# Altium project Microcontroller Hardware.PrjPcb (part 1 of 3)
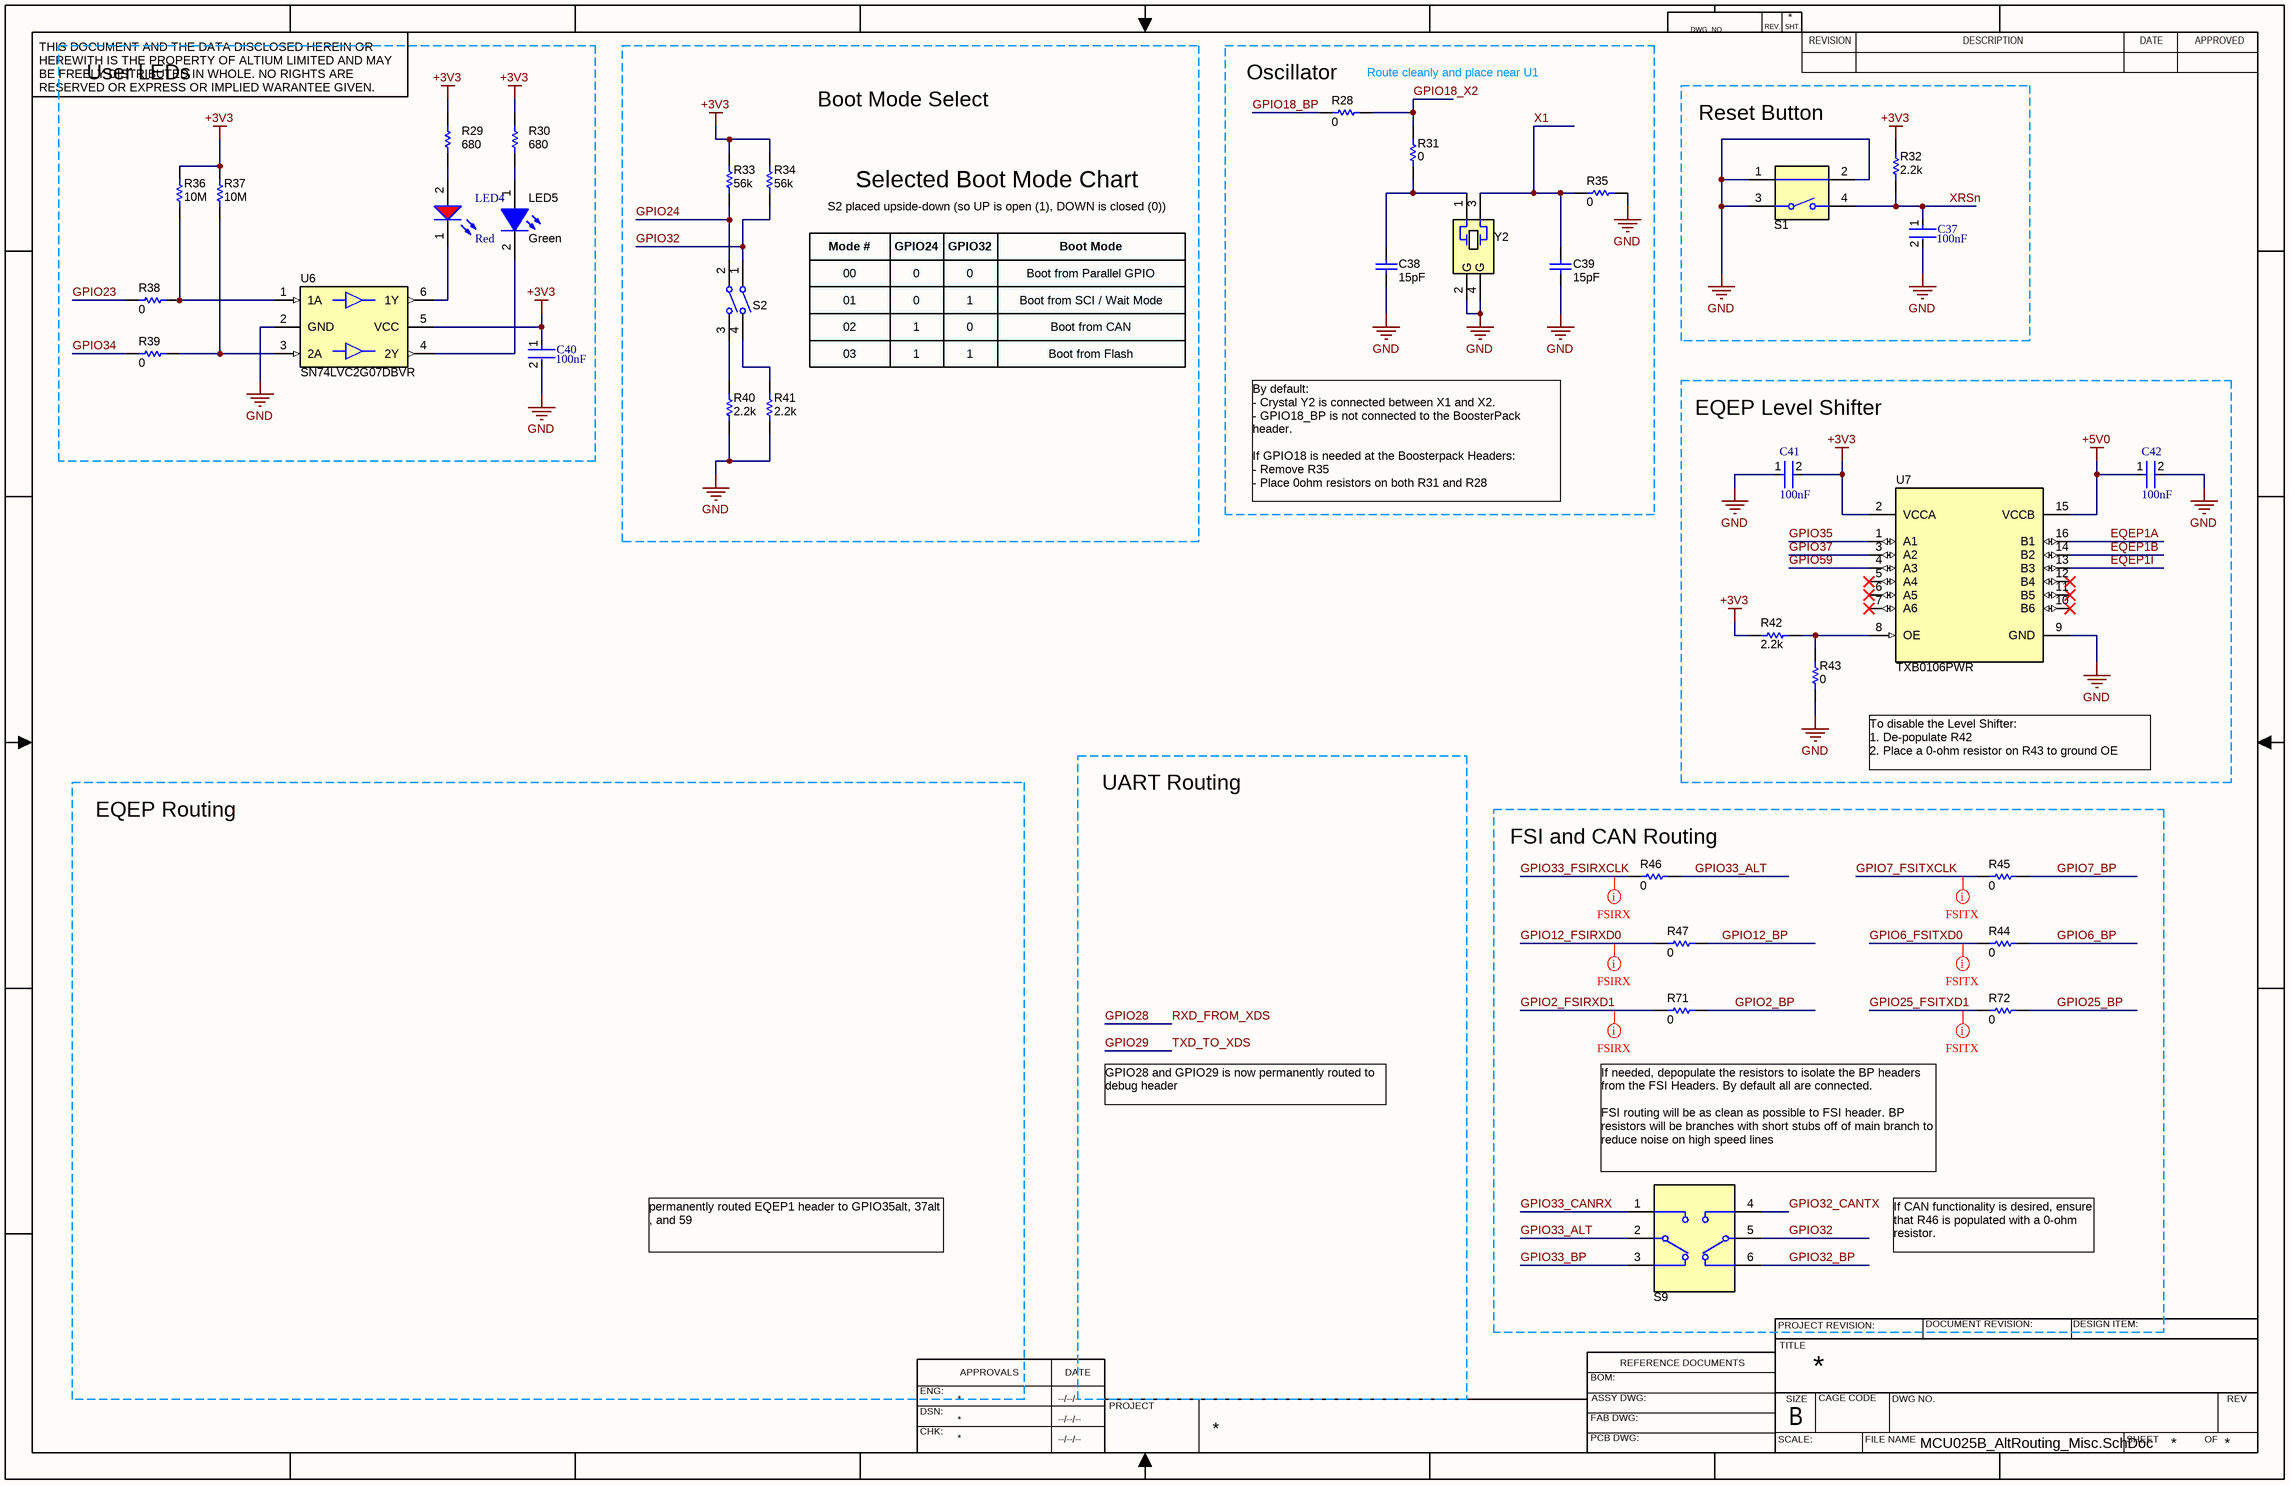
[diagram p0: MCU025B_AltRouting_Misc.SchDoc]
8 sheets, 205 parts. Net scope: global (net labels, ports and power ports of the same name join across sheets).
Board file: MCU025B.PcbDoc
Sheets:
  MCU025B_AltRouting_Misc.SchDoc
  MCU025B_Block_Diagram.SchDoc
  MCU025B_Connectors.SchDoc
  MCU025B_F280049C_Device.SchDoc
  MCU025B_Hardware.SchDoc
  MCU025B_XDS110_MCU.SchDoc
  MCU025B_XDS110_Target_Interface.SchDoc
  MCU025B_XDS110_USB_Power.SchDoc

## Sheet MCU025B_AltRouting_Misc.SchDoc
size 431 x 279 mm; PageSetup: Record=PageOptions|CenterHorizontal=True|CenterVertical=True|PrintScale=1.00|XCorrection=1.00|YCorrection=1.00|PrintKind=0|BorderSize=5000000|LeftOffset=0|BottomOffset=0|Orientation=2|PaperLength=1000|PaperWidth=1000|Scale=100|PaperSource=15|PrintQuality=600|MediaType=1|DitherType=10|PaperKind=Letter|PrintScaleMode=1; Organization: ORGANIZATION; Address1: ADDRESS 1; Address2: ADDRESS 2; Address3: ADDRESS 3; Address4: ADDRESS 4; Revision: -; ENG_APP_DATE: --/--/--; DSN_APP_DATE: --/--/--; CHK_APP_DATE: --/--/--

### Parts
C37  Capacitance: 100nF  [FP-CL10-IPC_C]  (hidden comment: CL10B104KA8NFNC)
C38  ValueDisplayed: 15pF  [0402]  (hidden comment: GRM1555C1H150JA01D)
C39  ValueDisplayed: 15pF  [0402]  (hidden comment: GRM1555C1H150JA01D)
C40  Capacitance: 100nF  [FP-CL10-IPC_C]  (hidden comment: CL10B104KA8NFNC)
C41  Capacitance: 100nF  [FP-CL10-IPC_C]  (hidden comment: CL10B104KA8NFNC)
C42  Capacitance: 100nF  [FP-CL10-IPC_C]  (hidden comment: CL10B104KA8NFNC)
LED4  Color: Red  [WL-SMCW_0805_150080xx75000]  (hidden comment: 150080SS75000)
LED5  value Green  [LED_LTST-C171]  (hidden comment: LTST-C171GKT)
R28  ValueDisplayed: 0  [0603]  (hidden comment: CRCW06030000Z0EA)
R29  ValueDisplayed: 680  [0402]  (hidden comment: CRCW0402680RJNED)
R30  ValueDisplayed: 680  [0402]  (hidden comment: CRCW0402680RJNED)
R31  ValueDisplayed: 0  [0603]  (hidden comment: CRCW06030000Z0EA)
R32  ValueDisplayed: 2.2k  [0402]  (hidden comment: CRCW04022K20JNED)
R33  ValueDisplayed: 56k  [0402]  (hidden comment: CRCW040256K0JNED)
R34  ValueDisplayed: 56k  [0402]  (hidden comment: CRCW040256K0JNED)
R35  ValueDisplayed: 0  [0603]  (hidden comment: CRCW06030000Z0EA)
R36  ValueDisplayed: 10M  [0402]  (hidden comment: CRCW040210M0JNED)
R37  ValueDisplayed: 10M  [0402]  (hidden comment: CRCW040210M0JNED)
R38  ValueDisplayed: 0  [0603]  (hidden comment: CRCW06030000Z0EA)
R39  ValueDisplayed: 0  [0603]  (hidden comment: CRCW06030000Z0EA)
R40  ValueDisplayed: 2.2k  [0402]  (hidden comment: CRCW04022K20JNED)
R41  ValueDisplayed: 2.2k  [0402]  (hidden comment: CRCW04022K20JNED)
R42  ValueDisplayed: 2.2k  [0603]  (hidden comment: CRCW06032K20JNEA)
R43  ValueDisplayed: 0  [0603]  (hidden comment: CRCW06030000Z0EA)
R44  ValueDisplayed: 0  [0603]  (hidden comment: CRCW06030000Z0EA)
R45  ValueDisplayed: 0  [0603]  (hidden comment: CRCW06030000Z0EA)
R46  ValueDisplayed: 0  [0603]  (hidden comment: CRCW06030000Z0EA)
R47  ValueDisplayed: 0  [0603]  (hidden comment: CRCW06030000Z0EA)
R71  ValueDisplayed: 0  [0603]  (hidden comment: CRCW06030000Z0EA)
R72  ValueDisplayed: 0  [0603]  (hidden comment: CRCW06030000Z0EA)
S1  1188E-1K2-V-TR  [SW_1188E]  (value not drawn)
S2  218-2LPST  [SW_218-2LP]  (value not drawn)
S9  CAS-220TA  [SW_CAS-220TA]  (value not drawn)
U6  SN74LVC2G07DBVR  [DBV0006A_N]
U7  TXB0106PWR  [PW0016A_N]
Y2  ECS-200-18-30B-AGN-TR  [ECS_ECX-53B]  (value not drawn)

### Nets
+3V3: C40.1 C41.2 R29.2 R30.2 R32.2 R33.2 R34.2 R36.2 R37.2 R42.1 U6.5(VCC) U7.2(VCCA)
+5V0: C42.1 U7.15(VCCB)
GND: C37.2 C38.2 C39.2 C40.2 C41.1 C42.2 R35.2 R40.1 R41.1 R43.1 S1.1 S1.2 S1.3 U6.2(GND) U7.9(GND) Y2.2(GND) Y2.4(GND)
EQEP1A: U7.16(B1)
EQEP1B: U7.14(B2)
EQEP1I: U7.13(B3)
GPIO2_BP: R71.2
GPIO2_FSIRXD1: R71.1
GPIO6_BP: R44.2
GPIO6_FSITXD0: R44.1
GPIO7_BP: R45.2
GPIO7_FSITXCLK: R45.1
GPIO12_BP: R47.2
GPIO12_FSIRXD0: R47.1
GPIO18_BP: R28.1
GPIO18_X2: R28.2 R31.2
GPIO23: R38.1
GPIO24: R33.1 S2.2
GPIO25_BP: R72.2
GPIO25_FSITXD1: R72.1
GPIO32: R34.1 S2.1 S9.5
GPIO32_BP: S9.6
GPIO32_CANTX: S9.4
GPIO33_ALT: R46.2 S9.2
GPIO33_BP: S9.3
GPIO33_CANRX: S9.1
GPIO33_FSIRXCLK: R46.1
GPIO34: R39.1
GPIO35: U7.1(A1)
GPIO37: U7.3(A2)
GPIO59: U7.4(A3)
X1: C39.1 R35.1 Y2.3
XRSn: C37.1 R32.1 S1.4
NetC38_1: C38.1 R31.1 Y2.1
NetLED4_1: LED4.1(K) U6.6(1Y)
NetLED4_2: LED4.2(A) R29.1
NetLED5_1: LED5.1(A) R30.1
NetLED5_2: LED5.2(K) U6.4(2Y)
NetR36_1: R36.1 R38.2 U6.1(1A)
NetR37_1: R37.1 R39.2 U6.3(2A)
NetR40_2: R40.2 S2.3
NetR41_2: R41.2 S2.4
NetR42_2: R42.2 R43.2 U7.8(OE)

Not connected (* = marked no-connect by the designer): U7 5(A4)* 6(A5)* 7(A6)* 10(B6)* 11(B5)* 12(B4)*

### Layout directives
net class FSIRX: GPIO2_FSIRXD1, GPIO12_FSIRXD0, GPIO33_FSIRXCLK
net class FSITX: GPIO6_FSITXD0, GPIO7_FSITXCLK, GPIO25_FSITXD1

### Notes on the sheet
- User LEDs
- Boot Mode Select
- (near R28) Oscillator
- (near R28) Route cleanly and place near U1
- Reset Button
- Selected Boot Mode Chart
- (near R34) S2 placed upside-down (so UP is open (1), DOWN is closed (0))
- Mode #
- 00
- 01
- GPIO24
- 0
- GPIO32
- 1
- Boot Mode
- Boot from Parallel GPIO
- Boot from SCI / Wait Mode
- 02
- 03
- Boot from CAN
- Boot from Flash
- EQEP Level Shifter
- By default:
  - Crystal Y2 is connected between X1 and X2.
  - GPIO18_BP is not connected to the BoosterPack header.
  If GPIO18 is needed at the Boosterpack Headers:
  - Remove R35
  - Place 0ohm resistors on both R31 and R28
- To disable the Level Shifter:
  1. De-populate R42
  2. Place a 0-ohm resistor on R43 to ground OE
- EQEP Routing
- UART Routing
- (near R46) FSI and CAN Routing
- GPIO28 and GPIO29 is now permanently routed to debug header
- If needed, depopulate the resistors to isolate the BP headers from the FSI Headers. By default all are connected.
  FSI routing will be as clean as possible to FSI header. BP resistors will be branches with short stubs off of main branch to reduce noise on high speed lines
- permanently routed EQEP1 header to GPIO35alt, 37alt , and 59
- If CAN functionality is desired, ensure that R46 is populated with a 0-ohm resistor.
- DWG. NO.
- REV.
- SHT.
- THIS DOCUMENT AND THE DATA DISCLOSED HEREIN OR HEREWITH IS THE PROPERTY OF ALTIUM LIMITED AND MAY BE FREELY DISTRIBUTED IN WHOLE. NO RIGHTS ARE RESERVED OR EXPRESS OR IMPLIED WARANTEE GIVEN.
- REVISION
- DESCRIPTION
- DATE
- APPROVED
- APPROVALS
- REFERENCE DOCUMENTS
- PROJECT REVISION:
- TITLE
- DOCUMENT REVISION:
- DESIGN ITEM:
- ENG:
- DSN:
- CHK:
- PROJECT
- BOM:
- FAB DWG:
- PCB DWG:
- ASSY DWG:
- SCALE:
- SIZE
- B
- CAGE CODE
- FILE NAME
- DWG NO.
- SHEET
- OF
- REV
- (in symbol CMP-0080365-1) G

### Library data of the parts
C37 C40-C42 = CMP-13271-001423-1: Cap Ceramic 100nF 25V X7R ±10% Pad SMD 0603 +125°C T/R; Depth: 0.8mm; Tolerance: 10%; Case Code (Imperial): 0603; Max Operating Temperature: 125°C; Min Operating Temperature: -55°C; Dielectric: X7R; Width: 0.031inch; Thickness: 0.035inch; Height: 0.8mm; Length: 1.6mm; Mount: Surface Mount; Voltage Rating: 25V; Case Code (Metric): 1608; Case/Package: 0603; Radiation Hardening: No; Packaging: Tape and Reel
C38 C39 = CMP-0006420-2: CAP, CERM, 15 pF, 50 V, +/- 5%, C0G/NP0, 0402; Manufacturer: MuRata; Polarized: N; Value: 15pF; U/M: EA; Value1: Unknown; VDC_V: 50V; TaMin_C: -55°C; TaMax_C: 125°C; SizeArea_mm2: 0.5; SizeAreaWB_mm2: 3; SizeX_mm: 1; SizeZ_mm: 0.6; AEC Category: Q200; CompType: Capacitor; PartNumber: GRM1555C1H150JA01D; PackageReference: 0402; RoHS: Y; Cap_F: 15pF; Tolerance_%: 5%; Value2: 50V; MountType: SMT; Technology: Ceramic; TempCo: C0G/NP0; Cap_Case: 0402; SizeY_mm: 0.5; Published: 2008-06-19; Publisher: Texas Instruments; LatestRevisionDate: 2017-03-09; ComponentLink1Description: Datasheet link; ComponentLink1URL: http://search.murata.co.jp/Ceramy/PnsearchViewAction.do?HnOFG=ON&HnNFG=ON&SEL_CNT=50&sLang=en&sKey=GRM1555C1H150JA01D&x=9&y=9&search=startwith; Supplier 1: Mouser; Supplier Part Number 1: 81-GRM1555C1H150JA1D; AEC Qualified: ?
LED4 = CMP-1426-00010-4: Led, Red, 630 Nm, 1.9 V, 30 Ma, 60 Mcd Rohs Compliant: Yes; Reverse Voltage: 5V; Test Current: 20mA; Forward Current: 100mA; Power Dissipation: 72mW; Peak Wavelength: 645nm; Lens Style: Clear, Rectangular; Viewing Angle: 140°; Forward Voltage: 1.9V; Luminous Intensity: 60mcd; Wavelength: 630nm; Max Junction Temperature (Tj): 95°C; Case/Package: 0805; Length: 2mm; RoHS: Compliant; Max Operating Temperature: 85°C; Min Operating Temperature: -40°C; Case Code (Metric): 2012; Case Code (Imperial): 0805; Dominant Wavelength: 630nm; Max Reverse Voltage (DC): 5V; REACH SVHC: Unknown; Packaging: Tape and Reel; Mount: Surface Mount; Width: 1.25mm; Height: 700µm
LED5 = CMP-0002830-2: LED, Green, SMD; Manufacturer: Lite-On; Type: AlInGaP; Vf_V: 2.1V; Io_A: 20A; Value1: W; SizeAreaWB_mm2: 6.75; SizeArea_mm2: 2.5; SizeX_mm: 2; SizeY_mm: 1.25; SizeZ_mm: 1.2; U/M: EA; CompType: LED; PartNumber: LTST-C171GKT; MountType: SMT; RoHS: Y; PackageReference: 0805 LED; Value2: 2.1V; Color: green; Published: 2008-07-11; Publisher: Texas Instruments; ComponentLink1URL: https://sps06.itg.ti.com/sites/KMS/crossdivteams/altium/docs/ComponentDatasheets/LTST-C171GKT.pdf; ComponentLink1Description: Datasheet link; LatestRevisionDate: 2017-03-09; Supplier 1: Digi-Key; Supplier Part Number 1: 160-1423-1-ND; Supplier 2: Mouser; Supplier Part Number 2: 859-LTST-C171GKT
R28 R31 R35 R38 R39 R43-R47 R71 R72 = CMP-0025697-4: RES, 0, 5%, 0.1 W, AEC-Q200 Grade 0, 0603; Manufacturer: Vishay-Dale; Value: 0; Value_Code: 0000; Power_W: 100mW; Value2: 0.1W; VDC_V: 75V; TempCo: 200 ppm/C; SizeArea_mm2: 1.28; SizeX_mm: 1.6; SizeY_mm: 0.8; SizeZ_mm: 1; EIA_Code: E24; AEC Category: Q200; AEC Qualified: Y; CompType: Resistor; PartNumber: CRCW06030000Z0EA; PackageReference: 0603; RoHS: E; Res_ohm: 0; Tolerance_%: 5%; Value1: 5%; MountType: SMT; Technology: Thick Film; ComponentLink1Description: Datasheet link; ComponentLink1URL: http://www.vishay.com/docs/20035/dcrcwe3.pdf; Supplier 1: Digi-Key; Supplier Part Number 1: 541-0.0GCT-ND; Supplier 2: Newark; Supplier Part Number 2: 52K8014; Supplier 3: Mouser; Supplier Part Number 3: 71-CRCW0603-0-E3; AEC Grade: 0
R29 R30 = CMP-0026962-3: RES, 680, 5%, 0.063 W, AEC-Q200 Grade 0, 0402; Manufacturer: Vishay-Dale; Power_W: 63mW; TempCo: 200 ppm/C; Value_Code: 680R; Value: 680; EIA_Code: E24; SizeX_mm: 1; SizeY_mm: 0.5; SizeZ_mm: 0.6; Value2: 0.063W; CompType: Resistor; AEC Qualified: Y; VDC_V: 50V; AEC Category: Q200; AEC Grade: 0; Supplier Part Number 2: 59M6744; Supplier 2: Newark; Supplier Part Number 3: 71-CRCW0402J-680-E3; Supplier 3: Mouser; RoHS: E; Value1: 5%; MountType: SMT; Supplier 1: Digi-Key; PackageReference: 0402; Tolerance_%: 5%; Res_ohm: 680; SizeArea_mm2: 0.5; PartNumber: CRCW0402680RJNED; ComponentLink1Description: Datasheet link; Supplier Part Number 1: 541-680JCT-ND; Technology: Thick Film; ComponentLink1URL: http://www.vishay.com/docs/20035/dcrcwe3.pdf
R32 R40 R41 = CMP-0026890-5: RES, 2.2 k, 5%, 0.063 W, AEC-Q200 Grade 0, 0402; Manufacturer: Vishay-Dale; Value: 2.2k; Value_Code: 2k20; Power_W: 63mW; Value2: 0.063W; VDC_V: 50V; TempCo: 200 ppm/C; SizeArea_mm2: 0.5; SizeX_mm: 1; SizeZ_mm: 0.6; EIA_Code: E24; AEC Category: Q200; AEC Qualified: Y; AEC Grade: 0; CompType: Resistor; PartNumber: CRCW04022K20JNED; PackageReference: 0402; RoHS: E; Res_ohm: 2.2k; Tolerance_%: 5%; Value1: 5%; MountType: SMT; Technology: Thick Film; SizeY_mm: 0.5; ComponentLink1Description: Datasheet link; ComponentLink1URL: http://www.vishay.com/docs/20035/dcrcwe3.pdf; Supplier 1: Digi-Key; Supplier Part Number 1: 541-2.2KJCT-ND; Supplier 2: Newark; Supplier Part Number 2: 59M6710; Supplier 3: Mouser; Supplier Part Number 3: 71-CRCW0402J-2.2K-E3
R33 R34 = CMP-0026949-3: RES, 56 k, 5%, 0.063 W, AEC-Q200 Grade 0, 0402; Manufacturer: Vishay-Dale; Value: 56k; Value_Code: 56k0; Power_W: 63mW; Value2: 0.063W; VDC_V: 50V; TempCo: 200 ppm/C; SizeArea_mm2: 0.5; SizeX_mm: 1; SizeZ_mm: 0.6; EIA_Code: E24; AEC Category: Q200; AEC Qualified: Y; AEC Grade: 0; CompType: Resistor; PartNumber: CRCW040256K0JNED; PackageReference: 0402; RoHS: E; Res_ohm: 56k; Tolerance_%: 5%; Value1: 5%; MountType: SMT; Technology: Thick Film; SizeY_mm: 0.5; ComponentLink1Description: Datasheet link; ComponentLink1URL: http://www.vishay.com/docs/20035/dcrcwe3.pdf; Supplier 1: Digi-Key; Supplier Part Number 1: 541-56KJCT-ND; Supplier 2: Newark; Supplier Part Number 2: 89M6680; Supplier 3: Mouser; Supplier Part Number 3: 71-CRCW0402J-56K-E3
R36 R37 = CMP-0026826-2: RES, 10 M, 5%, 0.063 W, AEC-Q200 Grade 0, 0402; Manufacturer: Vishay-Dale; Value: 10Meg; Value_Code: 10M0; Power_W: 63mW; Value2: 0.063W; VDC_V: 50V; TempCo: 200 ppm/C; SizeArea_mm2: 0.5; SizeX_mm: 1; SizeZ_mm: 0.6; EIA_Code: E24; AEC Category: Q200; AEC Qualified: Y; AEC Grade: 0; CompType: Resistor; PartNumber: CRCW040210M0JNED; PackageReference: 0402; RoHS: E; Res_ohm: 10M; Tolerance_%: 5%; Value1: 5%; MountType: SMT; Technology: Thick Film; SizeY_mm: 0.5; ComponentLink1Description: Datasheet link; ComponentLink1URL: http://www.vishay.com/docs/20035/dcrcwe3.pdf; Supplier 1: Digi-Key; Supplier Part Number 1: 541-10MJCT-ND; Supplier 2: Newark; Supplier Part Number 2: 59M6697; Supplier 3: Mouser; Supplier Part Number 3: 71-CRCW0402J-10M-E3
R42 = CMP-0025769-4: RES, 2.2 k, 5%, 0.1 W, AEC-Q200 Grade 0, 0603; Manufacturer: Vishay-Dale; Value: 2.2k; Value_Code: 2k20; Power_W: 100mW; Value2: 0.1W; VDC_V: 75V; TempCo: 200 ppm/C; SizeArea_mm2: 1.28; SizeX_mm: 1.6; SizeY_mm: 0.8; SizeZ_mm: 1; EIA_Code: E24; AEC Category: Q200; AEC Qualified: Y; AEC Grade: 0; CompType: Resistor; PartNumber: CRCW06032K20JNEA; PackageReference: 0603; RoHS: E; Res_ohm: 2.2k; Tolerance_%: 5%; Value1: 5%; MountType: SMT; Technology: Thick Film; ComponentLink1Description: Datasheet link; ComponentLink1URL: http://www.vishay.com/docs/20035/dcrcwe3.pdf; Supplier 1: Digi-Key; Supplier Part Number 1: 541-2.2KGCT-ND; Supplier 2: Newark; Supplier Part Number 2: 59M6776; Supplier 3: Farnell; Supplier Part Number 3: 1652868
S1 = CMP-0002328-1: Switch, SPST, 0.05 A, 12 VDC, SMD; Manufacturer: Diptronics; SizeAreaWB_mm2: 53.9; SizeArea_mm2: 27.3; SizeX_mm: 7.8; SizeY_mm: 3.5; VDC_V: 12V; PositionCount: 1; CurrentRating_mA: 50A; PartNumber: 1188E-1K2-V-TR; MountType: SMT; SizeZ_mm: 3.5; ComponentLink1Description: Datasheet URL; ComponentLink1URL: http://www.dip.com.tw/en/en-product-information/en-switch004/item/download/1976_b080c057386714e3a6604cbe658b9df3; RoHS: Y; Circuit: SPST; Orientation: Side Actuated; CompType: Switch; PackageReference: 7.8x3.5mm; Publisher: Texas Instruments; LatestRevisionDate: 2017-03-09
S2 = CMP-0002230-1: Switch, SPST, 2 Pos, 25mA, 24VDC, SMD; Manufacturer: CTS Electrocomponents; VDC_V: 24V; SwitchFunction: Off-On; PositionCount: 2; CurrentRating_mA: 25A; PartNumber: 218-2LPST; MountType: SMT; ComponentLink1Description: Datasheet Link; ComponentLink1URL: http://www.ctscorp.com/components/Datasheets/218.pdf; RoHS: Y; Circuit: SPST; Orientation: Top Actuated; CompType: Switch; PackageReference: 3.71x5.8mm; Publisher: Texas Instruments; LatestRevisionDate: 2017-03-09; Supplier 1: Digi-Key; Supplier Part Number 1: CT2182LPST-ND; Supplier 2: Mouser; Supplier Part Number 2: 774-2182LPST
S9 = CMP-0002123-2: SLIDE SWITCH DPDT  .1A, SMT; Manufacturer: Copal Electronics; VDC_V: 6V; SwitchFunction: On-On; PositionCount: 2; CurrentRating_mA: 100A; PartNumber: CAS-220TA; MountType: SMT; ComponentLink1Description: Datasheet URL; ComponentLink1URL: http://copal-electronics.info/en/0008e/02462.pdf; RoHS: Y; Circuit: DPDT; Orientation: Horizontal; CompType: Switch; PackageReference: SWITCH, 5.4x2.5x3.9mm; Publisher: Texas Instruments; LatestRevisionDate: 2017-03-09; Supplier 1: Digi-Key; Supplier Part Number 1: CAS220JCT-ND
U6 = CMP-0051789-2: Dual Buffer/Driver with Open-Drain Output, DBV0006A, LARGE T&R; Manufacturer: Texas Instruments; VCC(Min)(V): 1.65; VCC(Max)(V): 5.5; Output Type: CMOS; ICC @ Nom Voltage(Max)(mA): 0.01; Input Type: CMOS/TTL; Bits(#): 2; F @ Nom Voltage(Max)(Mhz): 150; Rating: Catalog; Technology Family: LVC; Voltage(Nom)(V): 1.8,2.5,3.3,5; Schmitt Trigger: No; Output Drive (IOL/IOH)(Max)(mA): 32/-32; tpd @ Nom Voltage(Max)(ns): 8.6,4.4,3.7,2.9; Logic: True; Sub-Family: Inverting Buffer/Driver; AEC Category: Q200; AEC Qualified: N; CompType: IC; Green_Lifecycle: Active; Green_REACh: Passed; SizeArea_mm2: 8.12; SizeAreaWB_mm2: 14.82; SizeX_mm: 2.8; SizeY_mm: 2.9; SizeZ_mm: 1.45; DatasheetVersion: SCES308K; PackageReference: DBV0006A; Generic Part Number: SN74LVC2G07; Operating Temperature Range(C): -40 to 125; 3-State Output: No; ComponentLink1Description: Datasheet Link; ComponentLink1URL: http://www.ti.com/lit/ds/symlink/sn74lvc2g07.pdf; ComponentLink2Description: Product Folder; ComponentLink2URL: http://www.ti.com/product/sn74lvc2g07; ComponentLink3Description: Online Datasheet; ComponentLink3URL: http://www.ti.com/product/sn74lvc2g07/datasheet; Green_EU RoHS-2: Passed; Green_EU RoHS: Passed; MountType: SMT; PackageDescription: SOT-23-6; PartNumber: SN74LVC2G07DBVR; RoHS: Y
U7 = CMP-0067443-1: 6-Bit Bidirectional Voltage-Level Translator with Auto Direction Sensing and +/-15-kV ESD Protect, PW0016A (TSSOP-16); Manufacturer: Texas Instruments; SizeArea_mm2: 32.0; SizeAreaWB_mm2: 58.8; SizeX_mm: 6.4; SizeY_mm: 5.0; SizeZ_mm: 1.2; CompType: IC; U/M: EA; Green_Lifecycle: Active; Green_REACh: Passed; PartNumber: TXB0106PWR; PackageReference: PW0016A; PackageDescription: TSSOP-16; MountType: SMT; ComponentLink1Description: Datasheet Link; ComponentLink1URL: http://www.ti.com/lit/ds/symlink/txb0106.pdf; RoHS: Y; Publisher: Texas Instruments; LatestRevisionDate: 2017-06-09; Alternate Manufacturer: Texas Instruments; Green_EU RoHS: Passed; Green_EU RoHS-2: Passed; Footprint Path 6: C:\AltiumLibraries\Footprints\TI\.PcbLib
Y2 = CMP-0080365-1: Crystal, 20 MHz, 25 ppm, 18, SMD; Manufacturer: ECS Inc.; Frequency Stability: 30 ppm; AEC Qualified: N; Frequency Tolerance: 25 ppm; AEC Category: Q200; TaMax_C: 85°C; Frequency_Fixed: 20MHz; TaMin_C: -40°C; Load Capacitance: 18; ComponentLink1Description: Datasheet Link; RoHS: Y; Supplier 1: Digi-Key; PackageReference: 5x3.2mm; PartNumber: ECS-200-18-30B-AGN-TR; Supplier Part Number 2: 520-200-18-30B-AGNT; Supplier 2: Mouser; AEC Grade: N/A; ComponentLink1URL: http://www.ecsxtal.com/store/pdf/ecx_53b.pdf; CompType: Crystal; Supplier Part Number 1: XC2693CT-ND; MountType: SMT

## Sheet MCU025B_Block_Diagram.SchDoc
size 431 x 279 mm; PageSetup: Record=PageOptions|CenterHorizontal=True|CenterVertical=True|PrintScale=1.00|XCorrection=1.00|YCorrection=1.00|PrintKind=0|BorderSize=5000000|LeftOffset=0|BottomOffset=0|Orientation=2|PaperLength=1000|PaperWidth=1000|Scale=100|PaperSource=15|PrintQuality=600|MediaType=1|DitherType=10|PaperKind=Letter|PrintScaleMode=1; Organization: ORGANIZATION; Address1: ADDRESS 1; Address2: ADDRESS 2; Address3: ADDRESS 3; Address4: ADDRESS 4; Revision: -; ENG_APP_DATE: --/--/--; DSN_APP_DATE: --/--/--; CHK_APP_DATE: --/--/--

### Notes on the sheet
- DWG. NO.
- REV.
- SHT.
- THIS DOCUMENT AND THE DATA DISCLOSED HEREIN OR HEREWITH IS THE PROPERTY OF ALTIUM LIMITED AND MAY BE FREELY DISTRIBUTED IN WHOLE. NO RIGHTS ARE RESERVED OR EXPRESS OR IMPLIED WARANTEE GIVEN.
- REVISION
- DESCRIPTION
- DATE
- APPROVED
- APPROVALS
- REFERENCE DOCUMENTS
- PROJECT REVISION:
- TITLE
- DOCUMENT REVISION:
- DESIGN ITEM:
- ENG:
- DSN:
- CHK:
- PROJECT
- BOM:
- FAB DWG:
- PCB DWG:
- ASSY DWG:
- SCALE:
- SIZE
- B
- CAGE CODE
- FILE NAME
- DWG NO.
- SHEET
- OF
- REV
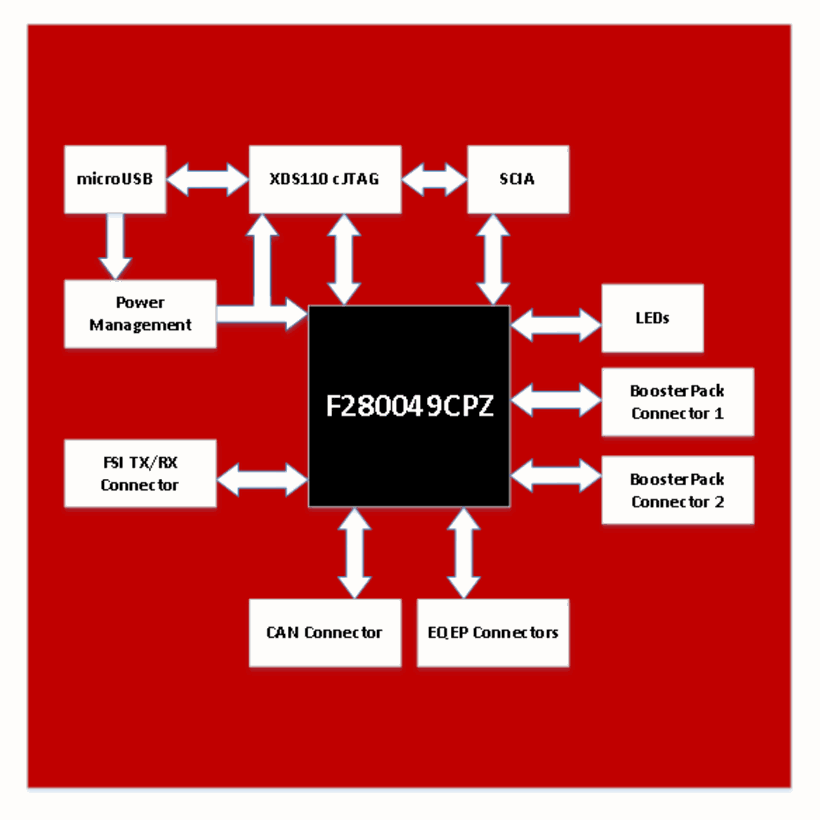
[diagram p1: MCU025B_Block_Diagram.SchDoc]

## Sheet MCU025B_Connectors.SchDoc
size 431 x 279 mm; PageSetup: Record=PageOptions|CenterHorizontal=True|CenterVertical=True|PrintScale=1.00|XCorrection=1.00|YCorrection=1.00|PrintKind=0|BorderSize=5000000|LeftOffset=0|BottomOffset=0|Orientation=2|PaperLength=1000|PaperWidth=1000|Scale=100|PaperSource=15|PrintQuality=600|MediaType=1|DitherType=10|PaperKind=Letter|PrintScaleMode=1; Organization: ORGANIZATION; Address1: ADDRESS 1; Address2: ADDRESS 2; Address3: ADDRESS 3; Address4: ADDRESS 4; Revision: -; ENG_APP_DATE: --/--/--; DSN_APP_DATE: --/--/--; CHK_APP_DATE: --/--/--
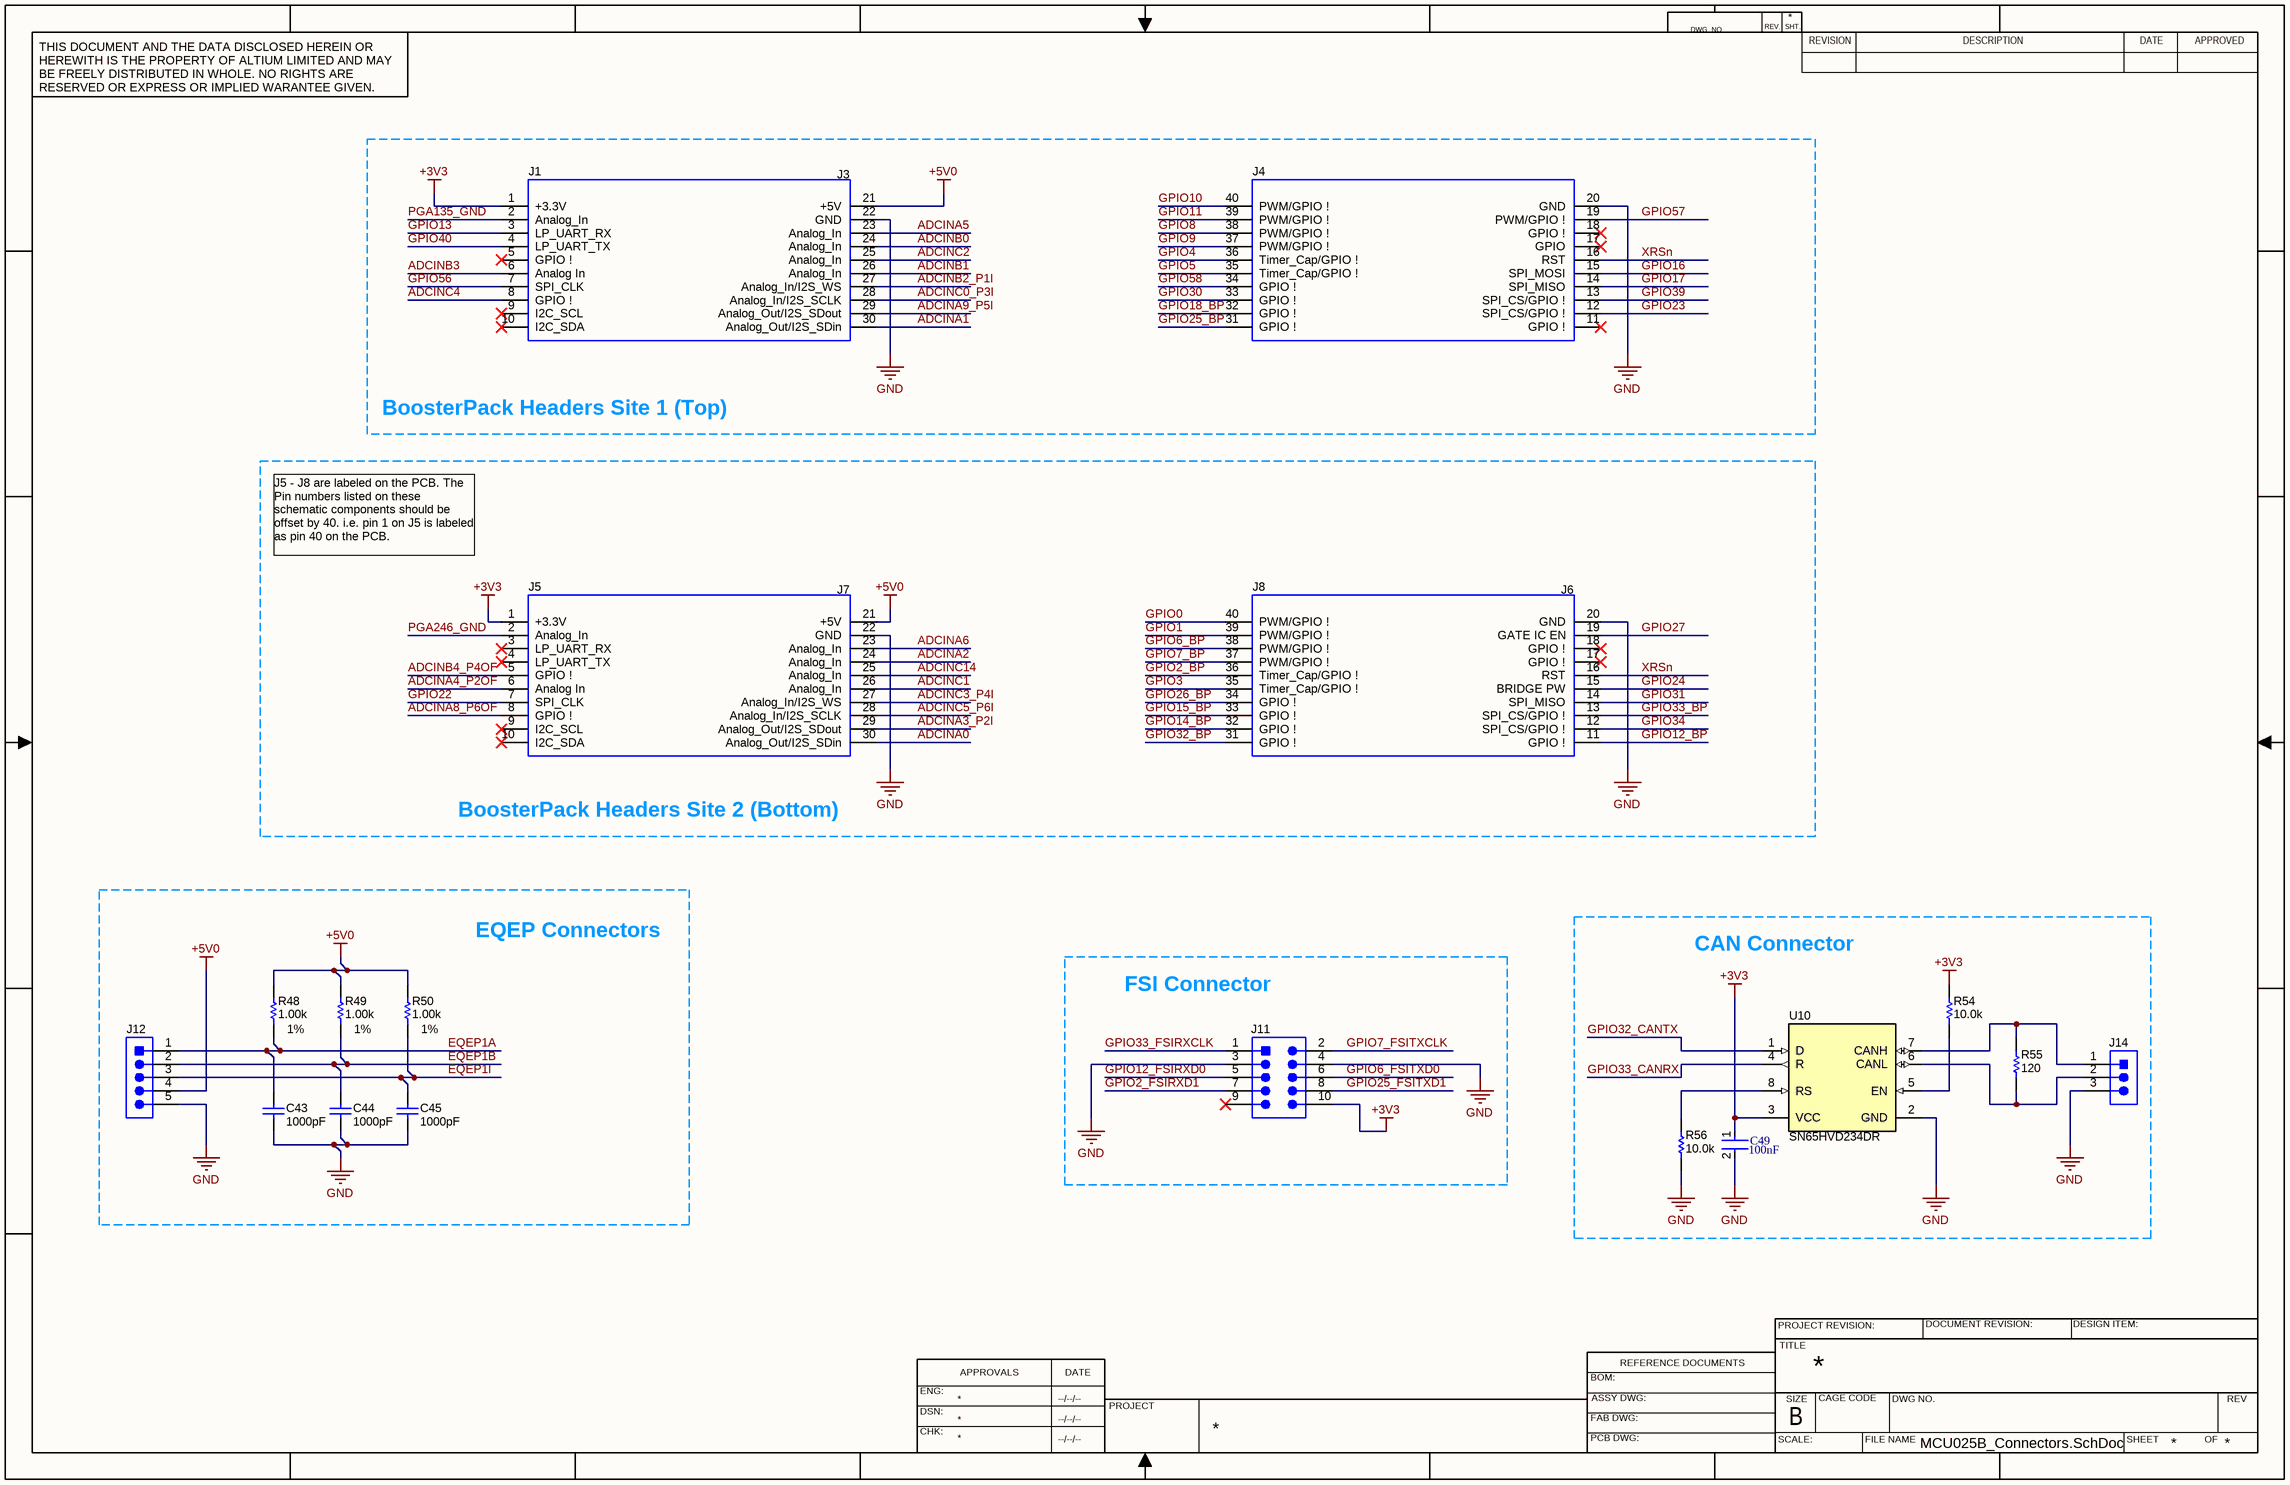
[diagram p2: MCU025B_Connectors.SchDoc]

### Parts
(Parts that share a designator on the sheet are numbered #1, #2 ... from top to bottom, then left to right.)
C43  ValueDisplayed: 1000pF  [0402]  (hidden comment: GRM155R71H102KA01D)
C44  ValueDisplayed: 1000pF  [0402]  (hidden comment: GRM155R71H102KA01D)
C45  ValueDisplayed: 1000pF  [0402]  (hidden comment: GRM155R71H102KA01D)
C49  Capacitance: 100nF  [FP-CL10-IPC_C]  (hidden comment: CL10B104KA8NFNC)
J1  SSQ-110-03-T-D  [BoosterPack_40pin_J1J3]  (value not drawn)
J4#1  SSQ-110-03-T-D  [BoosterPack_40pin_J2J4]  (value not drawn)
J5  SSQ-110-03-T-D  [BoosterPack_40pin_J1J3]  (value not drawn)
J8  SSQ-110-03-T-D  [BoosterPack_40pin_J2J4]  (value not drawn)
J11  TSW-105-07-G-D  [TSW-105-07-G-D]  (value not drawn)
J12  TSW-105-07-G-S  [TSW-105-07-X-S]  (value not drawn)
J14  61300311121  [WURTH_61300311121]  (value not drawn)
R48  ValueDisplayed: 1.00k  Value1: 1%  [0402]  (hidden comment: CRCW04021K00FKED)
R49  ValueDisplayed: 1.00k  Value1: 1%  [0402]  (hidden comment: CRCW04021K00FKED)
R50  ValueDisplayed: 1.00k  Value1: 1%  [0402]  (hidden comment: CRCW04021K00FKED)
R54  ValueDisplayed: 10.0k  [0402]  (hidden comment: CRCW040210K0FKED)
R55  ValueDisplayed: 120  [0603]  (hidden comment: RC0603FR-07120RL)
R56  ValueDisplayed: 10.0k  [0402]  (hidden comment: CRCW040210K0FKED)
U10  SN65HVD234DR  [D0008A_L]

### Nets
+3V3: C49.1 J1.1(+3.3V) J5.1(+3.3V) J11.10 R54.2 U10.3(VCC)
+5V0: J1.21(+5V) J5.21(+5V) J12.4 R48.2 R49.2 R50.2
GND: C43.2 C44.2 C45.2 C49.2 J1.22(GND) J4#1.20(GND) J5.22(GND) J8.20(GND) J11.3 J11.4 J12.5 J14.3 R56.1 U10.2(GND)
ADCINA0: J5.30(Analog_Out/I2S_SDin)
ADCINA1: J1.30(Analog_Out/I2S_SDin)
ADCINA2: J5.24(Analog_In)
ADCINA3_P2I: J5.29(Analog_Out/I2S_SDout)
ADCINA4_P2OF: J5.6(Analog_In)
ADCINA5: J1.23(Analog_In)
ADCINA6: J5.23(Analog_In)
ADCINA8_P6OF: J5.8(GPIO_!)
ADCINA9_P5I: J1.29(Analog_Out/I2S_SDout)
ADCINB0: J1.24(Analog_In)
ADCINB1: J1.26(Analog_In)
ADCINB2_P1I: J1.27(Analog_In/I2S_WS)
ADCINB3: J1.6(Analog_In)
ADCINB4_P4OF: J5.5(GPIO_!)
ADCINC0_P3I: J1.28(Analog_In/I2S_SCLK)
ADCINC1: J5.26(Analog_In)
ADCINC2: J1.25(Analog_In)
ADCINC3_P4I: J5.27(Analog_In/I2S_WS)
ADCINC4: J1.8(GPIO_!)
ADCINC5_P6I: J5.28(Analog_In/I2S_SCLK)
ADCINC14: J5.25(Analog_In)
EQEP1A: C43.1 J12.1 R48.1
EQEP1B: C44.1 J12.2 R49.1
EQEP1I: C45.1 J12.3 R50.1
GPIO0: J8.40(PWM/GPIO_!)
GPIO1: J8.39(PWM/GPIO_!)
GPIO2_BP: J8.36(Timer_Cap/GPIO_!)
GPIO2_FSIRXD1: J11.7
GPIO3: J8.35(Timer_Cap/GPIO_!)
GPIO4: J4#1.36(Timer_Cap/GPIO_!)
GPIO5: J4#1.35(Timer_Cap/GPIO_!)
GPIO6_BP: J8.38(PWM/GPIO_!)
GPIO6_FSITXD0: J11.6
GPIO7_BP: J8.37(PWM/GPIO_!)
GPIO7_FSITXCLK: J11.2
GPIO8: J4#1.38(PWM/GPIO_!)
GPIO9: J4#1.37(PWM/GPIO_!)
GPIO10: J4#1.40(PWM/GPIO_!)
GPIO11: J4#1.39(PWM/GPIO_!)
GPIO12_BP: J8.11(GPIO_!)
GPIO12_FSIRXD0: J11.5
GPIO13: J1.3(LP_UART_RX)
GPIO14_BP: J8.32(GPIO_!)
GPIO15_BP: J8.33(GPIO_!)
GPIO16: J4#1.15(SPI_MOSI)
GPIO17: J4#1.14(SPI_MISO)
GPIO18_BP: J4#1.32(GPIO_!)
GPIO22: J5.7(SPI_CLK)
GPIO23: J4#1.12(SPI_CS/GPIO_!)
GPIO24: J8.15(BRIDGE_PW)
GPIO25_BP: J4#1.31(GPIO_!)
GPIO25_FSITXD1: J11.8
GPIO26_BP: J8.34(GPIO_!)
GPIO27: J8.19(GATE_IC_EN)
GPIO30: J4#1.33(GPIO_!)
GPIO31: J8.14(SPI_MISO)
GPIO32_BP: J8.31(GPIO_!)
GPIO32_CANTX: U10.1(D)
GPIO33_BP: J8.13(SPI_CS/GPIO_!)
GPIO33_CANRX: U10.4(R)
GPIO33_FSIRXCLK: J11.1
GPIO34: J8.12(SPI_CS/GPIO_!)
GPIO39: J4#1.13(SPI_CS/GPIO_!)
GPIO40: J1.4(LP_UART_TX)
GPIO56: J1.7(SPI_CLK)
GPIO57: J4#1.19(PWM/GPIO_!)
GPIO58: J4#1.34(GPIO_!)
PGA135_GND: J1.2(Analog_In)
PGA246_GND: J5.2(Analog_In)
XRSn: J4#1.16(RST) J8.16(RST)
NetJ14_1: J14.1 R55.2 U10.7(CANH)
NetJ14_2: J14.2 R55.1 U10.6(CANL)
NetR54_1: R54.1 U10.5(EN)
NetR56_2: R56.2 U10.8(RS)

Not connected (* = marked no-connect by the designer): J1 5(GPIO_!)* 9(I2C_SCL)* 10(I2C_SDA)*; J4#1 11(GPIO_!)* 17(GPIO)* 18(GPIO_!)*; J5 3(LP_UART_RX)* 4(LP_UART_TX)* 9(I2C_SCL)* 10(I2C_SDA)*; J8 17(GPIO_!)* 18(GPIO_!)*; J11 9*

### Notes on the sheet
- (near J1) J3
- BoosterPack Headers Site 1 (Top)
- J5 - J8 are labeled on the PCB. The Pin numbers listed on these schematic components should be offset by 40. i.e. pin 1 on J5 is labeled as pin 40 on the PCB.
- (near J5) J7
- (near J8) J6
- BoosterPack Headers Site 2 (Bottom)
- EQEP Connectors
- CAN Connector
- FSI Connector
- DWG. NO.
- REV.
- SHT.
- THIS DOCUMENT AND THE DATA DISCLOSED HEREIN OR HEREWITH IS THE PROPERTY OF ALTIUM LIMITED AND MAY BE FREELY DISTRIBUTED IN WHOLE. NO RIGHTS ARE RESERVED OR EXPRESS OR IMPLIED WARANTEE GIVEN.
- REVISION
- DESCRIPTION
- DATE
- APPROVED
- APPROVALS
- REFERENCE DOCUMENTS
- PROJECT REVISION:
- TITLE
- DOCUMENT REVISION:
- DESIGN ITEM:
- ENG:
- DSN:
- CHK:
- PROJECT
- BOM:
- FAB DWG:
- PCB DWG:
- ASSY DWG:
- SCALE:
- SIZE
- B
- CAGE CODE
- FILE NAME
- DWG NO.
- SHEET
- OF
- REV

### Library data of the parts
C43-C45 = CMP-0006673-2: CAP, CERM, 1000 pF, 50 V, +/- 10%, X7R, 0402; Manufacturer: MuRata; Polarized: N; Value: 1000pF; U/M: EA; Cap_F: 1nF; Value1: Unknown; VDC_V: 50V; TaMin_C: -55°C; TaMax_C: 125°C; SizeArea_mm2: 0.5; SizeAreaWB_mm2: 3; SizeX_mm: 1; SizeZ_mm: 0.6; AEC Category: Q200; CompType: Capacitor; PartNumber: GRM155R71H102KA01D; PackageReference: 0402; RoHS: Y; Tolerance_%: 10%; Value2: 50V; MountType: SMT; Technology: Ceramic; TempCo: X7R; Cap_Case: 0402; SizeY_mm: 0.5; Published: 2008-06-19; Publisher: Texas Instruments; LatestRevisionDate: 2017-03-09; ComponentLink1Description: Datasheet link; ComponentLink1URL: http://search.murata.co.jp/Ceramy/PnsearchViewAction.do?HnOFG=ON&HnNFG=ON&SEL_CNT=50&sLang=en&sKey=GRM155R71H102KA01D&x=9&y=9&search=startwith; Supplier 1: Digi-Key; Supplier Part Number 1: 490-1303-1-ND; Supplier 2: Newark; Supplier Part Number 2: 14T3283; Supplier 3: Mouser; Supplier Part Number 3: 81-GRM36X102K50; AEC Qualified: ?
C49 = CMP-13271-001423-1: as C37 on sheet MCU025B_AltRouting_Misc; Depth: 0.8mm; Tolerance: 10%; Case Code (Imperial): 0603; Max Operating Temperature: 125°C; Min Operating Temperature: -55°C; Dielectric: X7R; Width: 0.031inch; Thickness: 0.035inch; Height: 0.8mm; Length: 1.6mm; Mount: Surface Mount; Voltage Rating: 25V; Case Code (Metric): 1608; Case/Package: 0603; Radiation Hardening: No; Packaging: Tape and Reel
J1 J5 = CMP-0003837-2: Receptacle, 2.54mm, 10x2, Tin, TH; Manufacturer: Samtec; Alternate Manufacturer: Major League Electronics; Alternate PartNumber: CRD-081413-A-G; Note: Booster Pack 40 pin J1 and J3; Green_Lifecycle: Active; Green_REACh: Incomplete; CompType: Receptacle; PartNumber: SSQ-110-03-T-D; RoHS: Y; PackageReference: 10x2 Receptacle; MountType: TH; ComponentLink1Description: Datasheet Link; ComponentLink1URL: https://www.samtec.com/ftppub/cpdf/SSQ-1XX-XX-XXX-X-XX-XXX-XX-X-MKT.pdf; Supplier 1: Digi-Key; Supplier Part Number 1: SAM1204-10-ND; Supplier 2: Newark; Supplier Part Number 2: 11P8392; Green_EU RoHS-2: Passed; Green_EU RoHS: Passed
J4#1 J8 = CMP-0078266-2: Receptacle, 2.54mm, 10x2, Tin, TH; Manufacturer: Samtec; Alternate Manufacturer: Major League Electronics; Alternate PartNumber: CRD-081413-A-G; Note: Booster Pack 40 pin J2 and J4; Green_Lifecycle: Active; Green_REACh: Incomplete; CompType: Receptacle; PartNumber: SSQ-110-03-T-D; RoHS: Y; PackageReference: 10x2 Receptacle; MountType: TH; ComponentLink1Description: Datasheet Link; Supplier 1: Digi-Key; Supplier Part Number 1: SAM1204-10-ND; Green_EU RoHS: Passed; Green_EU RoHS-2: Passed; ComponentLink1URL: https://www.samtec.com/ftppub/cpdf/SSQ-1XX-XX-XXX-X-XX-XXX-XX-X-MKT.pdf; Supplier 2: Newark; Supplier Part Number 2: 11P8392
J11 = CMP-0075410-2: Header, 100mil, 5x2, Gold, TH; Manufacturer: Samtec; Pitch_mm: 2.54; Cert_VDE: N; Gender: Male; Cert_CSA: Y; Voltage_V: 550V; Green_REACh: Passed; Current_A: 6.3A; Green_Lifecycle: Active; Row_Count: 2; ComponentLink1Description: Datasheet URL; RoHS: Y; Supplier 1: Digi-Key; Cert_UL: Y; Orientation: Vertical; Green_EU RoHS: Passed; PackageReference: 5x2 Header; Color: Black; PartNumber: TSW-105-07-G-D; PinCount: 10; ContactFinish: Gold; Cert_CULUS: N; Shrouded: N; ClassName: Header; RowSpacing_mm: 2.54; ComponentLink1URL: http://samtec.com/ftppub/pdf/TSW_TH.PDF; CompType: Header; MountType: TH; Supplier Part Number 1: SAM1028-05-ND; Green_EU RoHS-2: Passed
J12 = CMP-0075411-1: Header, 100mil, 5x1, Gold, TH; Manufacturer: Samtec; Pitch_mm: 2.54; Cert_VDE: N; Gender: Male; Cert_CSA: Y; Voltage_V: 550V; Green_REACh: Passed; Current_A: 6.3A; CT: False; Green_Lifecycle: Active; Row_Count: 1; CNHeader: True; ComponentLink1Description: Datasheet URL; RoHS: Y; Supplier 1: Digi-Key; Cert_UL: Y; Orientation: Vertical; Green_EU RoHS: Passed; PackageReference: 5x1 Header; Color: Black; PartNumber: TSW-105-07-G-S; PinCount: 5; Publisher: Texas Instruments; ContactFinish: Gold; Cert_CULUS: N; Shrouded: N; ClassName: Header; ComponentLink1URL: http://samtec.com/ftppub/pdf/TSW_TH.PDF; LatestRevisionDate: 2017-07-12; CompType: Header; MountType: TH; Supplier Part Number 1: SAM1029-05-ND; Green_EU RoHS-2: Passed
J14 = CMP-0054796-1: Header, 2.54 mm, 3x1, Gold, TH; Manufacturer: Wurth Elektronik; Green_Lifecycle: Active; Green_REACh: Passed; CNHeader: TRUE; CT: FALSE; PartNumber: 61300311121; PackageReference: Header, 2.54mm, 3x1, TH; ClassName: Header; CompType: Header; RoHS: Y; MountType: TH; ComponentLink1Description: Datasheet URL; ComponentLink1URL: http://katalog.we-online.de/em/datasheet/6130xx11121.pdf; Publisher: Texas Instruments; LatestRevisionDate: 26/05/2017; Supplier 1: Digi-Key; Supplier Part Number 1: 732-5316-ND; Supplier 2: Newark; Supplier Part Number 2: 20X0950; Supplier 3: Farnell; Supplier Part Number 3: 356154; Green_EU RoHS: Passed; Green_EU RoHS-2: Incomplete
R48-R50 = CMP-0026071-3: RES, 1.00 k, 1%, 0.063 W, AEC-Q200 Grade 0, 0402; Manufacturer: Vishay-Dale; Value: 1.00k; Res_ohm: 1k; Value_Code: 1k00; Power_W: 63mW; Value2: 0.063W; VDC_V: 50V; TempCo: 100 ppm/C; SizeArea_mm2: 0.5; SizeX_mm: 1; SizeZ_mm: 0.6; EIA_Code: E96; AEC Category: Q200; AEC Qualified: Y; AEC Grade: 0; CompType: Resistor; PartNumber: CRCW04021K00FKED; PackageReference: 0402; RoHS: E; Tolerance_%: 1%; MountType: SMT; Technology: Thick Film; SizeY_mm: 0.5; ComponentLink1Description: Datasheet link; ComponentLink1URL: http://www.vishay.com/docs/20035/dcrcwe3.pdf; Supplier 1: Digi-Key; Supplier Part Number 1: 541-1.00KLCT-ND; Supplier 2: Newark; Supplier Part Number 2: 52K6545; Supplier 3: Mouser; Supplier Part Number 3: 71-CRCW0402-1.0K-E3
R54 R56 = CMP-0025958-3: RES, 10.0 k, 1%, 0.063 W, AEC-Q200 Grade 0, 0402; Manufacturer: Vishay-Dale; Value: 10.0k; Res_ohm: 10k; Value_Code: 10k0; Power_W: 63mW; Value2: 0.063W; VDC_V: 50V; TempCo: 100 ppm/C; SizeArea_mm2: 0.5; SizeX_mm: 1; SizeZ_mm: 0.6; EIA_Code: E96; AEC Category: Q200; AEC Qualified: Y; AEC Grade: 0; CompType: Resistor; PartNumber: CRCW040210K0FKED; PackageReference: 0402; RoHS: E; Tolerance_%: 1%; Value1: 1%; MountType: SMT; Technology: Thick Film; SizeY_mm: 0.5; ComponentLink1Description: Datasheet link; ComponentLink1URL: http://www.vishay.com/docs/20035/dcrcwe3.pdf; Supplier 1: Digi-Key; Supplier Part Number 1: 541-10.0KLCT-ND; Supplier 2: Newark; Supplier Part Number 2: 52K6595; Supplier 3: Mouser; Supplier Part Number 3: 71-CRCW0402-10K-E3
R55 = CMP-0022769-3: RES, 120, 1%, 0.1 W, 0603; Manufacturer: Yageo America; Value: 120; Value_Code: 120R; Power_W: 100mW; Value2: 0.1W; VDC_V: 150V; TempCo: 200 ppm/C; SizeArea_mm2: 1.28; SizeX_mm: 1.6; SizeY_mm: 0.8; SizeZ_mm: 1; U/M: EA; AEC Category: Q200; CompType: Resistor; PartNumber: RC0603FR-07120RL; PackageReference: 0603; RoHS: Y; Res_ohm: 120; Tolerance_%: 1%; Value1: 1%; MountType: SMT; Technology: Thick Film; Published: 2008-06-26; Publisher: Texas Instruments; LatestRevisionDate: 2017-03-09; ComponentLink1Description: Datasheet link; ComponentLink1URL: http://www.yageo.com/pdf/Pu-RC0603_51_PbFree_L_2.pdf; Supplier 1: Digi-Key; Supplier Part Number 1: 311-120HRCT-ND; Supplier 2: Mouser; Supplier Part Number 2: 603-RC0603FR-07120RL; Supplier 3: Farnell; Supplier Part Number 3: 9238379; AEC Qualified: ?
U10 = CMP-0033355-1: 3.3V CAN Transceiver with Sleep Mode, 6 mA, -40 to 125 degC, 8-pin SOIC (D), Green (RoHS & no Sb/Br); Manufacturer: Texas Instruments; Drivers Per Package: 1; Bus Fault Voltage(V): +/-30; Transient Pulse Protection(V): -100 to 100; ICC(Max)(mA): 6; Supply Voltage(s)(V): 3.3; Rating: Catalog; DatasheetVersion: SLLS557F; PackageVersion: revM, Jun-2011; PackageReference: D0008A; PackageDescription: 8-Pin Plastic Small Outline Integrated Circuit, 4.9 x 3.9 mm, Pitch 1.27 mm Pitch; Eco-Plan: Green (RoHS & no Sb/Br); SubFamily: CAN; Receivers Per Package: 1; Isolated: No; Low Power Mode: Sleep; Footprint: PCA82C250, excludes pin5; PartNumber: SN65HVD234DR; Code_JEDEC: MS-012AA; ComponentLink1Description: Datasheet; ComponentLink1URL: http://www.ti.com/general/docs/lit/getliterature.tsp?genericPartNumber=SN65HVD234&fileType=pdf; Mounting Technology: Surface Mount

## Sheet MCU025B_F280049C_Device.SchDoc
size 431 x 279 mm; PageSetup: Record=PageOptions|CenterHorizontal=True|CenterVertical=True|PrintScale=1.00|XCorrection=1.00|YCorrection=1.00|PrintKind=0|BorderSize=5000000|LeftOffset=0|BottomOffset=0|Orientation=2|PaperLength=1000|PaperWidth=1000|Scale=100|PaperSource=15|PrintQuality=600|MediaType=1|DitherType=10|PaperKind=Letter|PrintScaleMode=1; Organization: ORGANIZATION; Address1: ADDRESS 1; Address2: ADDRESS 2; Address3: ADDRESS 3; Address4: ADDRESS 4; Revision: -; ENG_APP_DATE: --/--/--; DSN_APP_DATE: --/--/--; CHK_APP_DATE: --/--/--
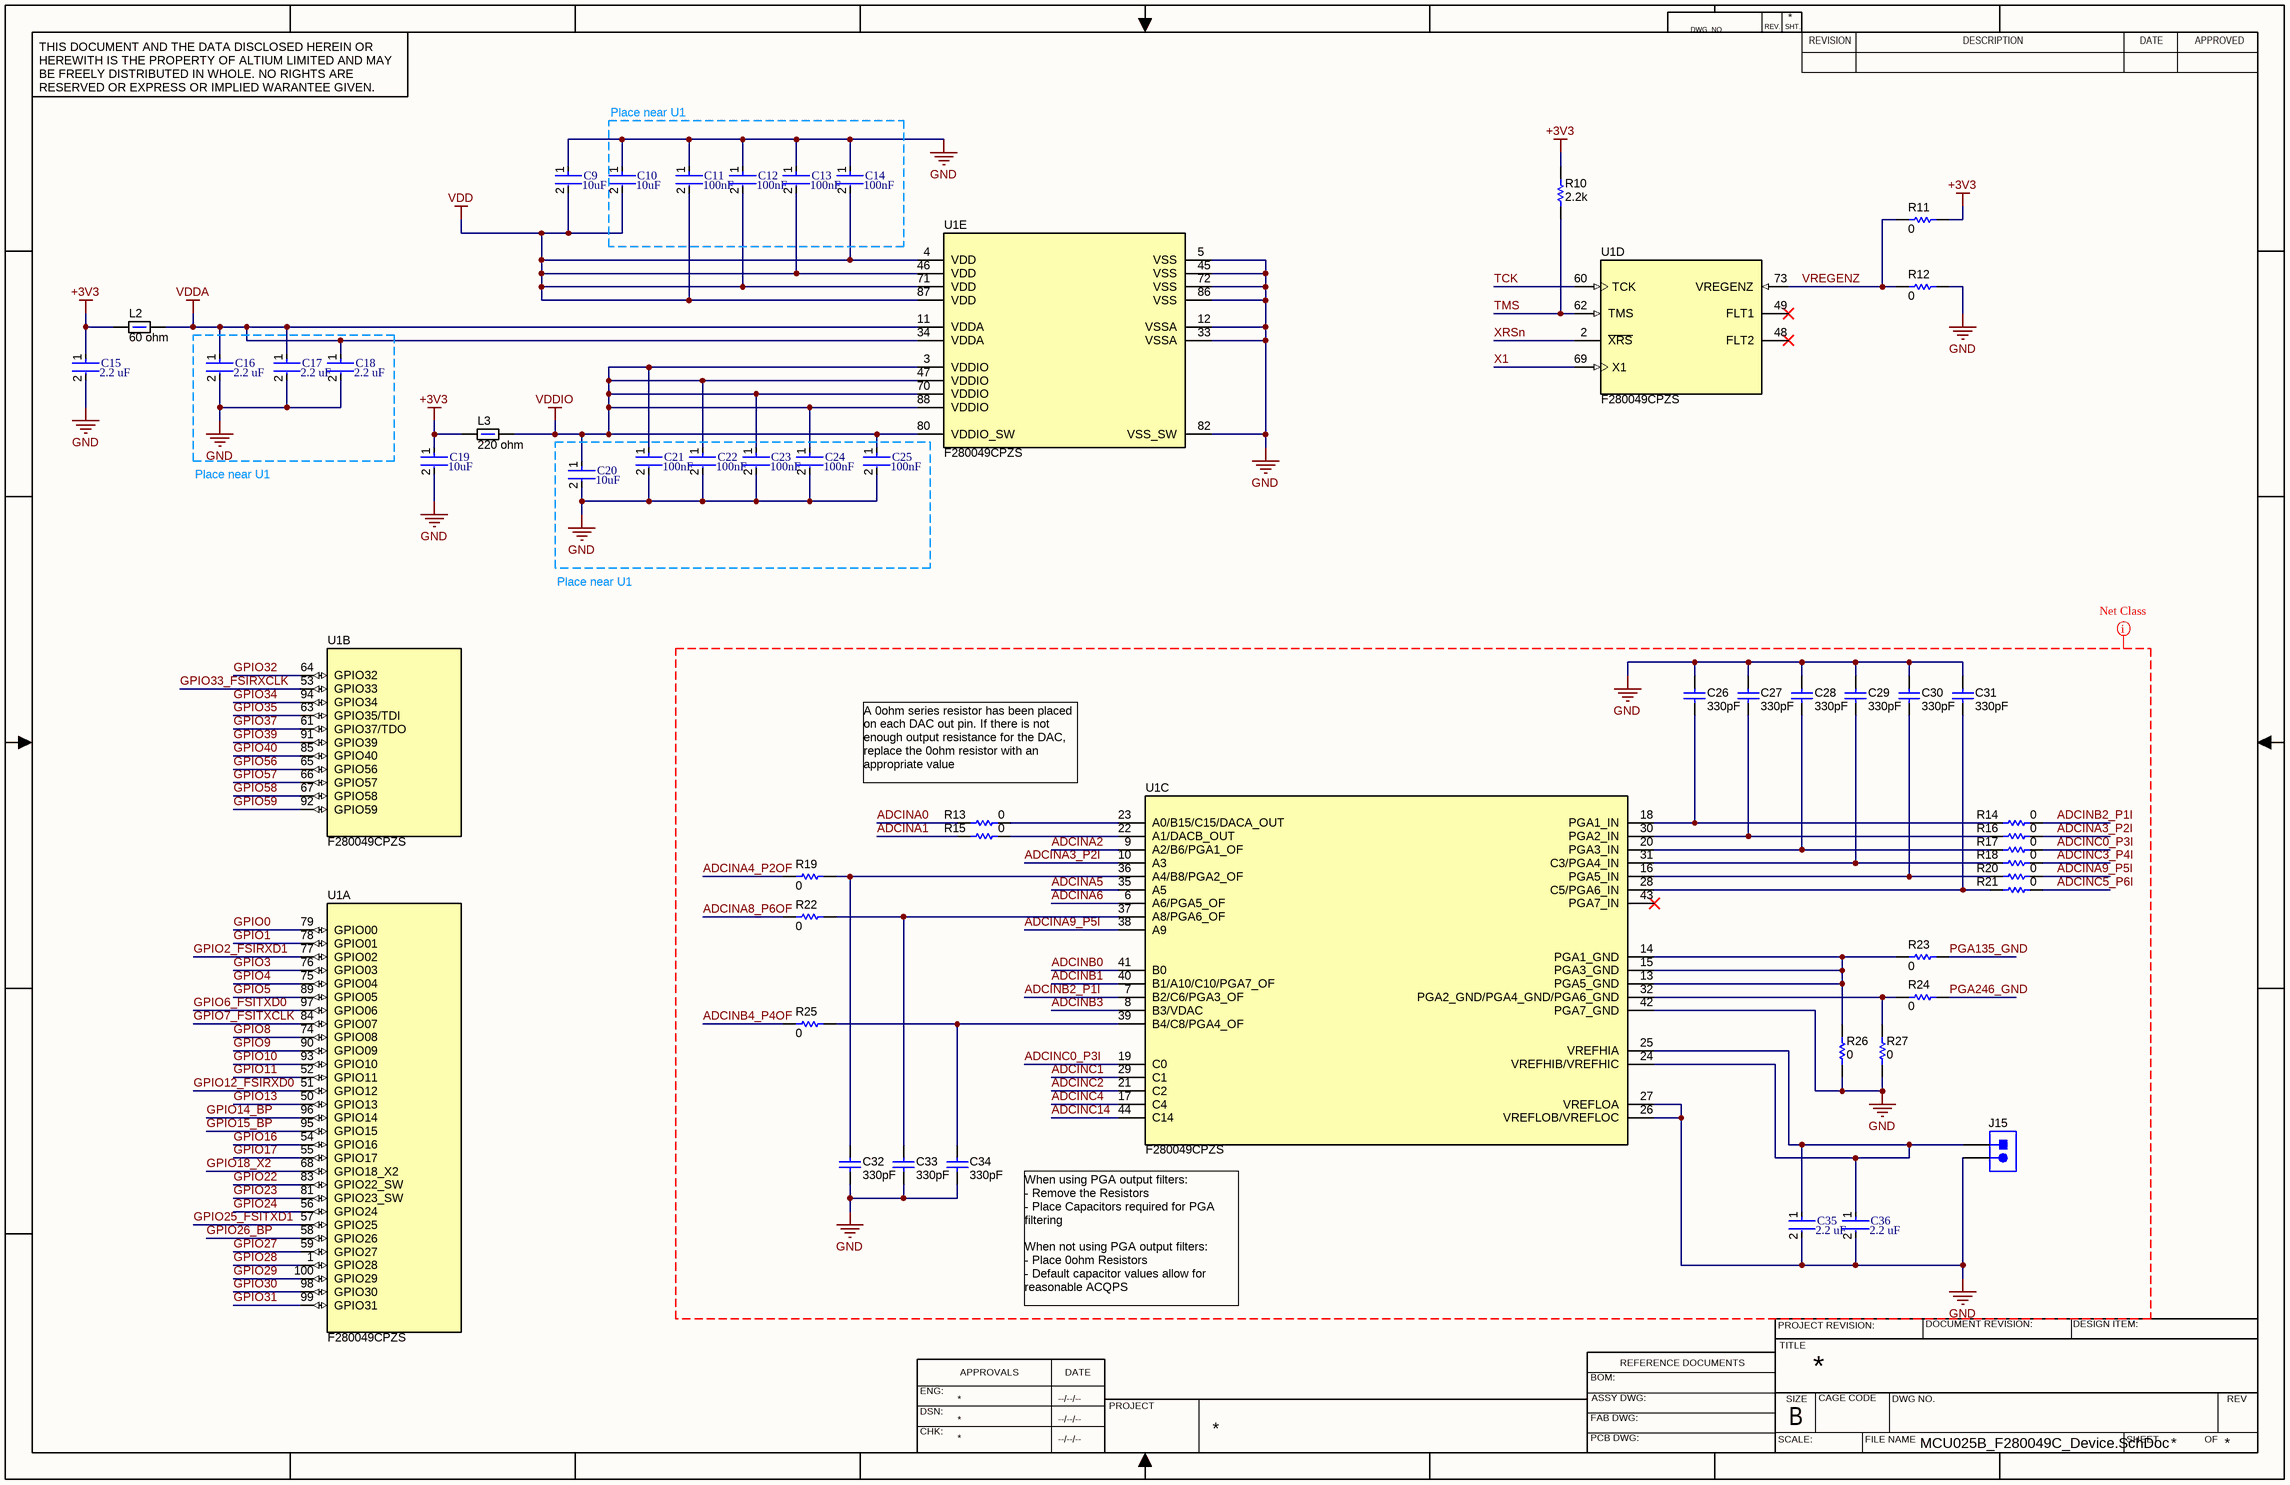
[diagram p3: MCU025B_F280049C_Device.SchDoc]

### Parts
C9  Capacitance: 10uF  [FP-GRM188-0_15-MFG]  (hidden comment: GRM188R61A106ME69D)
C10  Capacitance: 10uF  [FP-GRM188-0_15-MFG]  (hidden comment: GRM188R61A106ME69D)
C11  Capacitance: 100nF  [FP-CL10-IPC_C]  (hidden comment: CL10B104KA8NFNC)
C12  Capacitance: 100nF  [FP-CL10-IPC_C]  (hidden comment: CL10B104KA8NFNC)
C13  Capacitance: 100nF  [FP-CL10-IPC_C]  (hidden comment: CL10B104KA8NFNC)
C14  Capacitance: 100nF  [FP-CL10-IPC_C]  (hidden comment: CL10B104KA8NFNC)
C15  Capacitance: 2.2 uF  [FP-CC0805-0_85-MFG]  (hidden comment: CC0805KKX7R5BB225)
C16  Capacitance: 2.2 uF  [FP-CC0805-0_85-MFG]  (hidden comment: CC0805KKX7R5BB225)
C17  Capacitance: 2.2 uF  [FP-CC0805-0_85-MFG]  (hidden comment: CC0805KKX7R5BB225)
C18  Capacitance: 2.2 uF  [FP-CC0805-0_85-MFG]  (hidden comment: CC0805KKX7R5BB225)
C19  Capacitance: 10uF  [FP-GRM188-0_15-MFG]  (hidden comment: GRM188R61A106ME69D)
C20  Capacitance: 10uF  [FP-GRM188-0_15-MFG]  (hidden comment: GRM188R61A106ME69D)
C21  Capacitance: 100nF  [FP-CL10-IPC_C]  (hidden comment: CL10B104KA8NFNC)
C22  Capacitance: 100nF  [FP-CL10-IPC_C]  (hidden comment: CL10B104KA8NFNC)
C23  Capacitance: 100nF  [FP-CL10-IPC_C]  (hidden comment: CL10B104KA8NFNC)
C24  Capacitance: 100nF  [FP-CL10-IPC_C]  (hidden comment: CL10B104KA8NFNC)
C25  Capacitance: 100nF  [FP-CL10-IPC_C]  (hidden comment: CL10B104KA8NFNC)
C26  ValueDisplayed: 330pF  [0603]  (hidden comment: GRM1885C1H331JA01D)
C27  ValueDisplayed: 330pF  [0603]  (hidden comment: GRM1885C1H331JA01D)
C28  ValueDisplayed: 330pF  [0603]  (hidden comment: GRM1885C1H331JA01D)
C29  ValueDisplayed: 330pF  [0603]  (hidden comment: GRM1885C1H331JA01D)
C30  ValueDisplayed: 330pF  [0603]  (hidden comment: GRM1885C1H331JA01D)
C31  ValueDisplayed: 330pF  [0603]  (hidden comment: GRM1885C1H331JA01D)
C32  ValueDisplayed: 330pF  [0603]  (hidden comment: GRM1885C1H331JA01D)
C33  ValueDisplayed: 330pF  [0603]  (hidden comment: GRM1885C1H331JA01D)
C34  ValueDisplayed: 330pF  [0603]  (hidden comment: GRM1885C1H331JA01D)
C35  Capacitance: 2.2 uF  [FP-CC0805-0_85-MFG]  (hidden comment: CC0805KKX7R5BB225)
C36  Capacitance: 2.2 uF  [FP-CC0805-0_85-MFG]  (hidden comment: CC0805KKX7R5BB225)
J15  61300211121  [WURTH_61300211121]  (value not drawn)
L2  ValueDisplayed: 60 ohm  [0805]  (hidden comment: BKP2125HS600-T)
L3  ValueDisplayed: 220 ohm  [0805]  (hidden comment: BLM21PG221SN1D)
R10  ValueDisplayed: 2.2k  [0402]  (hidden comment: CRCW04022K20JNED)
R11  ValueDisplayed: 0  [0603]  (hidden comment: CRCW06030000Z0EA)
R12  ValueDisplayed: 0  [0603]  (hidden comment: CRCW06030000Z0EA)
R13  ValueDisplayed: 0  [0603]  (hidden comment: CRCW06030000Z0EA)
R14  ValueDisplayed: 0  [0603]  (hidden comment: CRCW06030000Z0EA)
R15  ValueDisplayed: 0  [0603]  (hidden comment: CRCW06030000Z0EA)
R16  ValueDisplayed: 0  [0603]  (hidden comment: CRCW06030000Z0EA)
R17  ValueDisplayed: 0  [0603]  (hidden comment: CRCW06030000Z0EA)
R18  ValueDisplayed: 0  [0603]  (hidden comment: CRCW06030000Z0EA)
R19  ValueDisplayed: 0  [0603]  (hidden comment: CRCW06030000Z0EA)
R20  ValueDisplayed: 0  [0603]  (hidden comment: CRCW06030000Z0EA)
R21  ValueDisplayed: 0  [0603]  (hidden comment: CRCW06030000Z0EA)
R22  ValueDisplayed: 0  [0603]  (hidden comment: CRCW06030000Z0EA)
R23  ValueDisplayed: 0  [0603]  (hidden comment: CRCW06030000Z0EA)
R24  ValueDisplayed: 0  [0603]  (hidden comment: CRCW06030000Z0EA)
R25  ValueDisplayed: 0  [0603]  (hidden comment: CRCW06030000Z0EA)
R26  ValueDisplayed: 0  [0603]  (hidden comment: CRCW06030000Z0EA)
R27  ValueDisplayed: 0  [0603]  (hidden comment: CRCW06030000Z0EA)
U1  F280049CPZS  [PZ0100A_N]  (parts A,B,C,D,E of 5)

### Nets
+3V3: C15.1 C19.1 L2.1 L3.1 R10.2 R11.2
GND: C9.1 C10.1 C11.1 C12.1 C13.1 C14.1 C15.2 C16.2 C17.2 C18.2 C19.2 C20.2 C21.2 C22.2 C23.2 C24.2 C25.2 C26.1 C27.1 C28.1 C29.1 C30.1 C31.1 C32.2 C33.2 C34.2 C35.2 C36.2 J15.2 R12.2 R26.1 R27.1 U1.5(VSS) U1.12(VSSA) U1.26(VREFLOB/VREFLOC) U1.27(VREFLOA) U1.33(VSSA) U1.42(PGA7_GND) U1.45(VSS) U1.72(VSS) U1.82(VSS_SW) U1.86(VSS)
VDD: C9.2 C10.2 C11.2 C12.2 C13.2 C14.2 U1.4(VDD) U1.46(VDD) U1.71(VDD) U1.87(VDD)
VDDA: C16.1 C17.1 C18.1 L2.2 U1.11(VDDA) U1.34(VDDA)
VDDIO: C20.1 C21.1 C22.1 C23.1 C24.1 C25.1 L3.2 U1.3(VDDIO) U1.47(VDDIO) U1.70(VDDIO) U1.80(VDDIO_SW) U1.88(VDDIO)
ADCINA0: R13.1
ADCINA1: R15.1
ADCINA2: U1.9(A2/B6/PGA1_OF)
ADCINA3_P2I: R16.2 U1.10(A3)
ADCINA4_P2OF: R19.1
ADCINA5: U1.35(A5)
ADCINA6: U1.6(A6/PGA5_OF)
ADCINA8_P6OF: R22.1
ADCINA9_P5I: R20.2 U1.38(A9)
ADCINB0: U1.41(B0)
ADCINB1: U1.40(B1/A10/C10/PGA7_OF)
ADCINB2_P1I: R14.2 U1.7(B2/C6/PGA3_OF)
ADCINB3: U1.8(B3/VDAC)
ADCINB4_P4OF: R25.1
ADCINC0_P3I: R17.2 U1.19(C0)
ADCINC1: U1.29(C1)
ADCINC2: U1.21(C2)
ADCINC3_P4I: R18.2
ADCINC4: U1.17(C4)
ADCINC5_P6I: R21.2
ADCINC14: U1.44(C14)
GPIO0: U1.79(GPIO00)
GPIO1: U1.78(GPIO01)
GPIO2_FSIRXD1: U1.77(GPIO02)
GPIO3: U1.76(GPIO03)
GPIO4: U1.75(GPIO04)
GPIO5: U1.89(GPIO05)
GPIO6_FSITXD0: U1.97(GPIO06)
GPIO7_FSITXCLK: U1.84(GPIO07)
GPIO8: U1.74(GPIO08)
GPIO9: U1.90(GPIO09)
GPIO10: U1.93(GPIO10)
GPIO11: U1.52(GPIO11)
GPIO12_FSIRXD0: U1.51(GPIO12)
GPIO13: U1.50(GPIO13)
GPIO14_BP: U1.96(GPIO14)
GPIO15_BP: U1.95(GPIO15)
GPIO16: U1.54(GPIO16)
GPIO17: U1.55(GPIO17)
GPIO18_X2: U1.68(GPIO18_X2)
GPIO22: U1.83(GPIO22_SW)
GPIO23: U1.81(GPIO23_SW)
GPIO24: U1.56(GPIO24)
GPIO25_FSITXD1: U1.57(GPIO25)
GPIO26_BP: U1.58(GPIO26)
GPIO27: U1.59(GPIO27)
GPIO28: U1.1(GPIO28)
GPIO29: U1.100(GPIO29)
GPIO30: U1.98(GPIO30)
GPIO31: U1.99(GPIO31)
GPIO32: U1.64(GPIO32)
GPIO33_FSIRXCLK: U1.53(GPIO33)
GPIO34: U1.94(GPIO34)
GPIO35: U1.63(GPIO35/TDI)
GPIO37: U1.61(GPIO37/TDO)
GPIO39: U1.91(GPIO39)
GPIO40: U1.85(GPIO40)
GPIO56: U1.65(GPIO56)
GPIO57: U1.66(GPIO57)
GPIO58: U1.67(GPIO58)
GPIO59: U1.92(GPIO59)
PGA135_GND: R23.2
PGA246_GND: R24.2
TCK: U1.60(TCK)
TMS: R10.1 U1.62(TMS)
VREGENZ: R11.1 R12.1 U1.73(VREGENZ)
X1: U1.69(X1)
XRSn: U1.2(~{XRS})
NetC26_2: C26.2 R14.1 U1.18(PGA1_IN)
NetC27_2: C27.2 R16.1 U1.30(PGA2_IN)
NetC28_2: C28.2 R17.1 U1.20(PGA3_IN)
NetC29_2: C29.2 R18.1 U1.31(C3/PGA4_IN)
NetC30_2: C30.2 R20.1 U1.16(PGA5_IN)
NetC31_2: C31.2 R21.1 U1.28(C5/PGA6_IN)
NetC32_1: C32.1 R19.2 U1.36(A4/B8/PGA2_OF)
NetC33_1: C33.1 R22.2 U1.37(A8/PGA6_OF)
NetC34_1: C34.1 R25.2 U1.39(B4/C8/PGA4_OF)
NetC35_1: C35.1 C36.1 J15.1 U1.24(VREFHIB/VREFHIC) U1.25(VREFHIA)
NetR13_2: R13.2 U1.23(A0/B15/C15/DACA_OUT)
NetR15_2: R15.2 U1.22(A1/DACB_OUT)
NetR23_1: R23.1 R26.2 U1.13(PGA5_GND) U1.14(PGA1_GND) U1.15(PGA3_GND)
NetR24_1: R24.1 R27.2 U1.32(PGA2_GND/PGA4_GND/PGA6_GND)

Not connected (* = marked no-connect by the designer): U1 43(PGA7_IN)* 48(FLT2)* 49(FLT1)*

### Layout directives
net class Analog: ADCINA0, ADCINA1, ADCINA2, ADCINA3_P2I, ADCINA4_P2OF, ADCINA5, ADCINA6, ADCINA8_P6OF, ADCINA9_P5I, ADCINB0, ADCINB1, ADCINB2_P1I, ADCINB3, ADCINB4_P4OF, ADCINC0_P3I, ADCINC1, ADCINC2, ADCINC3_P4I, ADCINC4, ADCINC5_P6I, ADCINC14, GND, PGA135_GND, PGA246_GND

### Notes on the sheet
- Place near U1
- A 0ohm series resistor has been placed on each DAC out pin. If there is not enough output resistance for the DAC, replace the 0ohm resistor with an appropriate value
- When using PGA output filters:
  - Remove the Resistors
  - Place Capacitors required for PGA filtering
  When not using PGA output filters:
  - Place 0ohm Resistors
  - Default capacitor values allow for reasonable ACQPS
- DWG. NO.
- REV.
- SHT.
- THIS DOCUMENT AND THE DATA DISCLOSED HEREIN OR HEREWITH IS THE PROPERTY OF ALTIUM LIMITED AND MAY BE FREELY DISTRIBUTED IN WHOLE. NO RIGHTS ARE RESERVED OR EXPRESS OR IMPLIED WARANTEE GIVEN.
- REVISION
- DESCRIPTION
- DATE
- APPROVED
- APPROVALS
- REFERENCE DOCUMENTS
- PROJECT REVISION:
- TITLE
- DOCUMENT REVISION:
- DESIGN ITEM:
- ENG:
- DSN:
- CHK:
- PROJECT
- BOM:
- FAB DWG:
- PCB DWG:
- ASSY DWG:
- SCALE:
- SIZE
- B
- CAGE CODE
- FILE NAME
- DWG NO.
- SHEET
- OF
- REV

### Library data of the parts
C9 C10 C19 C20 = CMP-06035-003612-1: Chip Multilayer Ceramic Capacitors for General Purpose, 0603, 10uF, X5R, 15%, 20%, 10V; Tolerance: 20%; Dielectric: X5R; Package Quantity: 4000; Width: 0.8mm; Case/Package: 0603; Thickness: 0.035inch; Voltage Rating: 10V; Voltage Rating (DC): 10V; Termination: SMD/SMT; Length: 1.6mm; Lead Free: Lead Free; Mount: Surface Mount; Height: 0.8mm; Depth: 0.8mm; Packaging: Tape and Reel; Weight: 0.000222oz; Min Operating Temperature: -55°C; Case Code (Metric): 1608; Max Operating Temperature: 85°C; Case Code (Imperial): 0603; Material: Ceramic
C11-C14 C21-C25 = CMP-13271-001423-1: as C37 on sheet MCU025B_AltRouting_Misc; Depth: 0.8mm; Tolerance: 10%; Case Code (Imperial): 0603; Max Operating Temperature: 125°C; Min Operating Temperature: -55°C; Dielectric: X7R; Width: 0.031inch; Thickness: 0.035inch; Height: 0.8mm; Length: 1.6mm; Mount: Surface Mount; Voltage Rating: 25V; Case Code (Metric): 1608; Case/Package: 0603; Radiation Hardening: No; Packaging: Tape and Reel
C15-C18 C35 C36 = CMP-03422-000945-1: CAP CER 2.2UF 6.3V X7R 0805; Manufacturer: Yageo; Tolerance: 0.1; Material: Ceramic; ComponentLink2URL: http://www.yageo.com/documents/recent/UPY-GPHC_Y5V_6.3V-to-50V_8.pdf; Package: CC0805-0.85; Temperature Range Low: -30°C; Temperature: -30°C to +85°C; Footprint Url: http://www.yageo.com/exep/pages/download/literatures/UPY-C_GEN_24.pdf; Category: Cap; Lead Free: Yes; Temperature Range High: +85°C; Octopart: https://octopart.com/cc0805kkx7r5bb225-yageo-29810442; Ipc Land Pattern Name: CAPC200125X85; RoHS: TRUE; Manufacturer Part Number: CC0805KKX7R5BB225; Height: 0.95mm; Value: 2.2 uF; Device Class L1: Passive Components; Automotive: No; Temperature Characteristic: X7R; Device Class L3: Ceramic Capacitors; Voltage Rating: 6.3 V; ComponentLink2Description: Datasheet; Device Class L2: Capacitors; Mouser Description: Multilayer Ceramic Capacitors MLCC - SMD/SMT 2.2uF 6.3V X7R 10%; Digikey Description: CAP CER 2.2UF 6.3V X7R 0805
C26-C34 = CMP-0007209-4: CAP, CERM, 330 pF, 50 V, +/- 5%, C0G/NP0, 0603; Manufacturer: MuRata; Polarized: N; Value: 330pF; U/M: EA; Value1: Unknown; VDC_V: 50V; TaMin_C: -55°C; TaMax_C: 125°C; SizeArea_mm2: 1.28; SizeAreaWB_mm2: 4.68; SizeX_mm: 1.6; SizeY_mm: 0.8; SizeZ_mm: 1; AEC Category: Q200; CompType: Capacitor; PartNumber: GRM1885C1H331JA01D; PackageReference: 0603; RoHS: Y; Cap_F: 330pF; Tolerance_%: 5%; Value2: 50V; MountType: SMT; Technology: Ceramic; TempCo: C0G/NP0; Cap_Case: 0603; Published: 2008-06-19; Publisher: Texas Instruments; LatestRevisionDate: 2017-03-09; ComponentLink1Description: Datasheet link; ComponentLink1URL: http://search.murata.co.jp/Ceramy/PnsearchViewAction.do?HnOFG=ON&HnNFG=ON&SEL_CNT=50&sLang=en&sKey=GRM1885C1H331JA01D&x=9&y=9&search=startwith; Supplier 1: Digi-Key; Supplier Part Number 1: 490-1439-1-ND; Supplier 2: Mouser; Supplier Part Number 2: 81-GRM39C331J50; Supplier 3: Farnell; Supplier Part Number 3: 8819890; AEC Qualified: ?
J15 = CMP-0054794-1: Header, 2.54 mm, 2x1, Gold, TH; Manufacturer: Wurth Elektronik; Green_Lifecycle: Active; Green_REACh: Passed; CNHeader: TRUE; CT: FALSE; PartNumber: 61300211121; PackageReference: Header, 2.54mm, 2x1, TH; ClassName: Header; CompType: Header; RoHS: Y; MountType: TH; ComponentLink1Description: Datasheet URL; ComponentLink1URL: http://katalog.we-online.de/em/datasheet/6130xx11121.pdf; Publisher: Texas Instruments; LatestRevisionDate: 26/05/2017; Supplier 1: Digi-Key; Supplier Part Number 1: 732-5315-ND; Supplier 2: Newark; Supplier Part Number 2: 20X0948; Supplier 3: Mouser; Supplier Part Number 3: 710-61300211121; Green_EU RoHS: Passed; Green_EU RoHS-2: Incomplete
L2 = CMP-0003306-1: Ferrite Bead, 60 ohm @ 100 MHz, 3 A, 0805; Manufacturer: Taiyo Yuden; Value: 60 ohm; Imax_A: 3A; DCR_ohm: 0.025; Value1: 0.025 ohm; SizeAreaWB_mm2: 6.75; SizeArea_mm2: 2.5; SizeX_mm: 2; SizeY_mm: 1.25; SizeZ_mm: 1.45; ZTyp@100MHz_Ohm: 60; PartNumber: BKP2125HS600-T; CompType: Ferrite Bead; Value2: 3A; MountType: SMT; PackageReference: 0805; Published: 2014-04-30; Publisher: Texas Instruments; LatestRevisionDate: 2017-03-09; ComponentLink1Description: Datasheet link; ComponentLink1URL: http://www.yuden.co.jp/productdata/catalog/en/mlci08_e.pdf; RoHS: Y; Supplier 1: Digi-Key; Supplier Part Number 1: 587-1932-1-ND; Supplier 2: Newark; Supplier Part Number 2: 30K5394 LF BKP2125HS600-T; Supplier 3: Mouser; Supplier Part Number 3: 963-BKP2125HS600-T
L3 = CMP-0003363-1: Ferrite Bead, 220 ohm @ 100 MHz, 2 A, 0805; Manufacturer: MuRata; Value: 220 ohm; Imax_A: 2A; DCR_ohm: 0.045; Value1: 0.045 ohm; SizeAreaWB_mm2: 6.75; SizeArea_mm2: 2.5; SizeX_mm: 2; SizeY_mm: 1.25; SizeZ_mm: 1.45; ZTyp@100MHz_Ohm: 220; PartNumber: BLM21PG221SN1D; CompType: Ferrite Bead; Value2: 2A; MountType: SMT; PackageReference: 0805; Published: 2014-04-30; Publisher: Texas Instruments; LatestRevisionDate: 2017-03-09; ComponentLink1Description: Datasheet link; ComponentLink1URL: http://search.murata.co.jp/Ceramy/image/img/PDF/ENG/L0110S0100BLM21P.pdf; RoHS: Y; Supplier 1: Digi-Key; Supplier Part Number 1: 490-1054-1-ND; Supplier 2: Newark; Supplier Part Number 2: 73M9167; Supplier 3: Mouser; Supplier Part Number 3: 81-BLM21P221SG
R10 = CMP-0026890-5: as R32 on sheet MCU025B_AltRouting_Misc; CompType: Resistor; PartNumber: CRCW04022K20JNED; PackageReference: 0402; RoHS: E; Res_ohm: 2.2k; Tolerance_%: 5%; Value1: 5%; MountType: SMT; Technology: Thick Film; SizeY_mm: 0.5; ComponentLink1Description: Datasheet link; ComponentLink1URL: http://www.vishay.com/docs/20035/dcrcwe3.pdf; Supplier 1: Digi-Key; Supplier Part Number 1: 541-2.2KJCT-ND; Supplier 2: Newark; Supplier Part Number 2: 59M6710; Supplier 3: Mouser; Supplier Part Number 3: 71-CRCW0402J-2.2K-E3
R11-R27 = CMP-0025697-4: as R28 on sheet MCU025B_AltRouting_Misc; CompType: Resistor; PartNumber: CRCW06030000Z0EA; PackageReference: 0603; RoHS: E; Res_ohm: 0; Tolerance_%: 5%; Value1: 5%; MountType: SMT; Technology: Thick Film; ComponentLink1Description: Datasheet link; ComponentLink1URL: http://www.vishay.com/docs/20035/dcrcwe3.pdf; Supplier 1: Digi-Key; Supplier Part Number 1: 541-0.0GCT-ND; Supplier 2: Newark; Supplier Part Number 2: 52K8014; Supplier 3: Mouser; Supplier Part Number 3: 71-CRCW0603-0-E3; AEC Grade: 0
U1 = CMP-0078352-1: Piccolo Microcontroller, PZ0100A (LQFP-100); Manufacturer: Texas Instruments; SizeZ_mm: 1.6; SizeX_mm: 16; AEC Category: Q200; AEC Qualified: N; SizeArea_mm2: 256; CompType: IC; SizeAreaWB_mm2: 324; ComponentLink1URL: http://www.ti.com/lit/ds/symlink/tms320f280049c.pdf; SizeY_mm: 16; PackageDescription: LQFP-100; ComponentLink2URL: http://www.ti.com/product/tms320f280049c; PackageReference: PZ0100A; ComponentLink2Description: Product Folder; PartNumber: F280049CPZS; MountType: SMT; ComponentLink1Description: Datasheet Link; Alternate Manufacturer: Texas Instruments; PartId: 1